# EAGLE schematic BEP33_12panel stencil (EAGLE 7.7.0), part 3 of 4
## Sheet 10 of 14
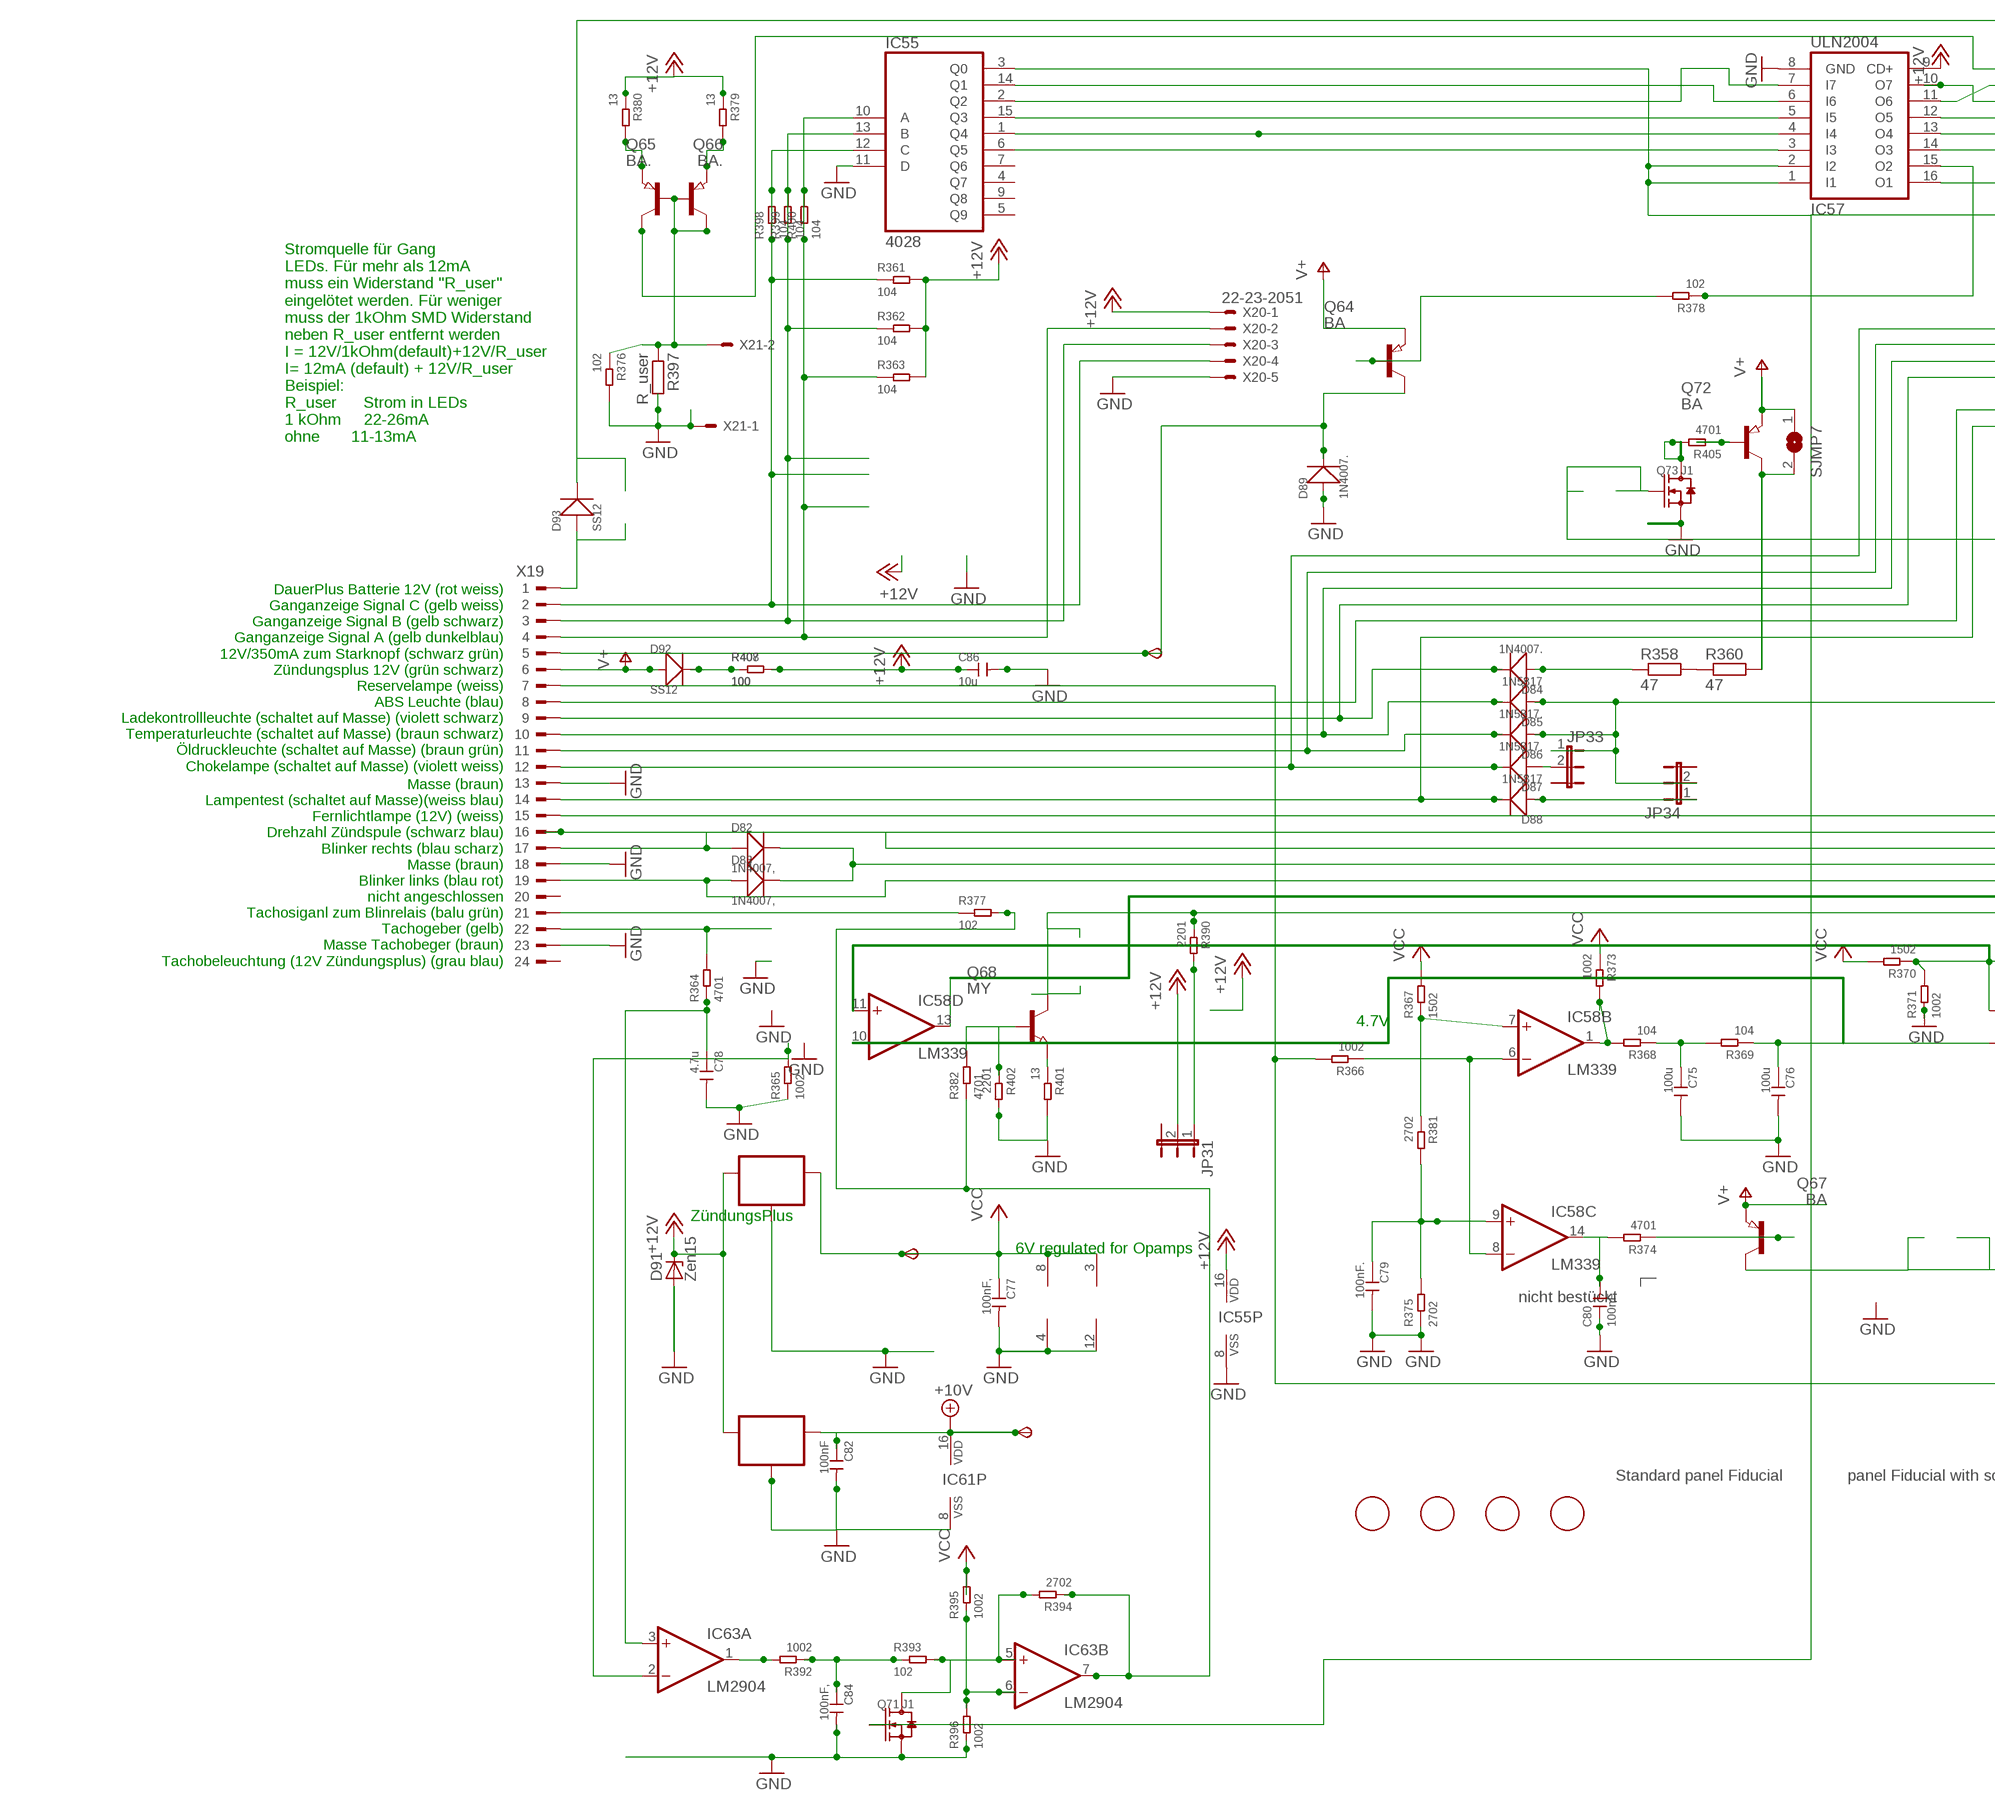
[diagram p16: schematic, sheet 10, part 1 of 2]
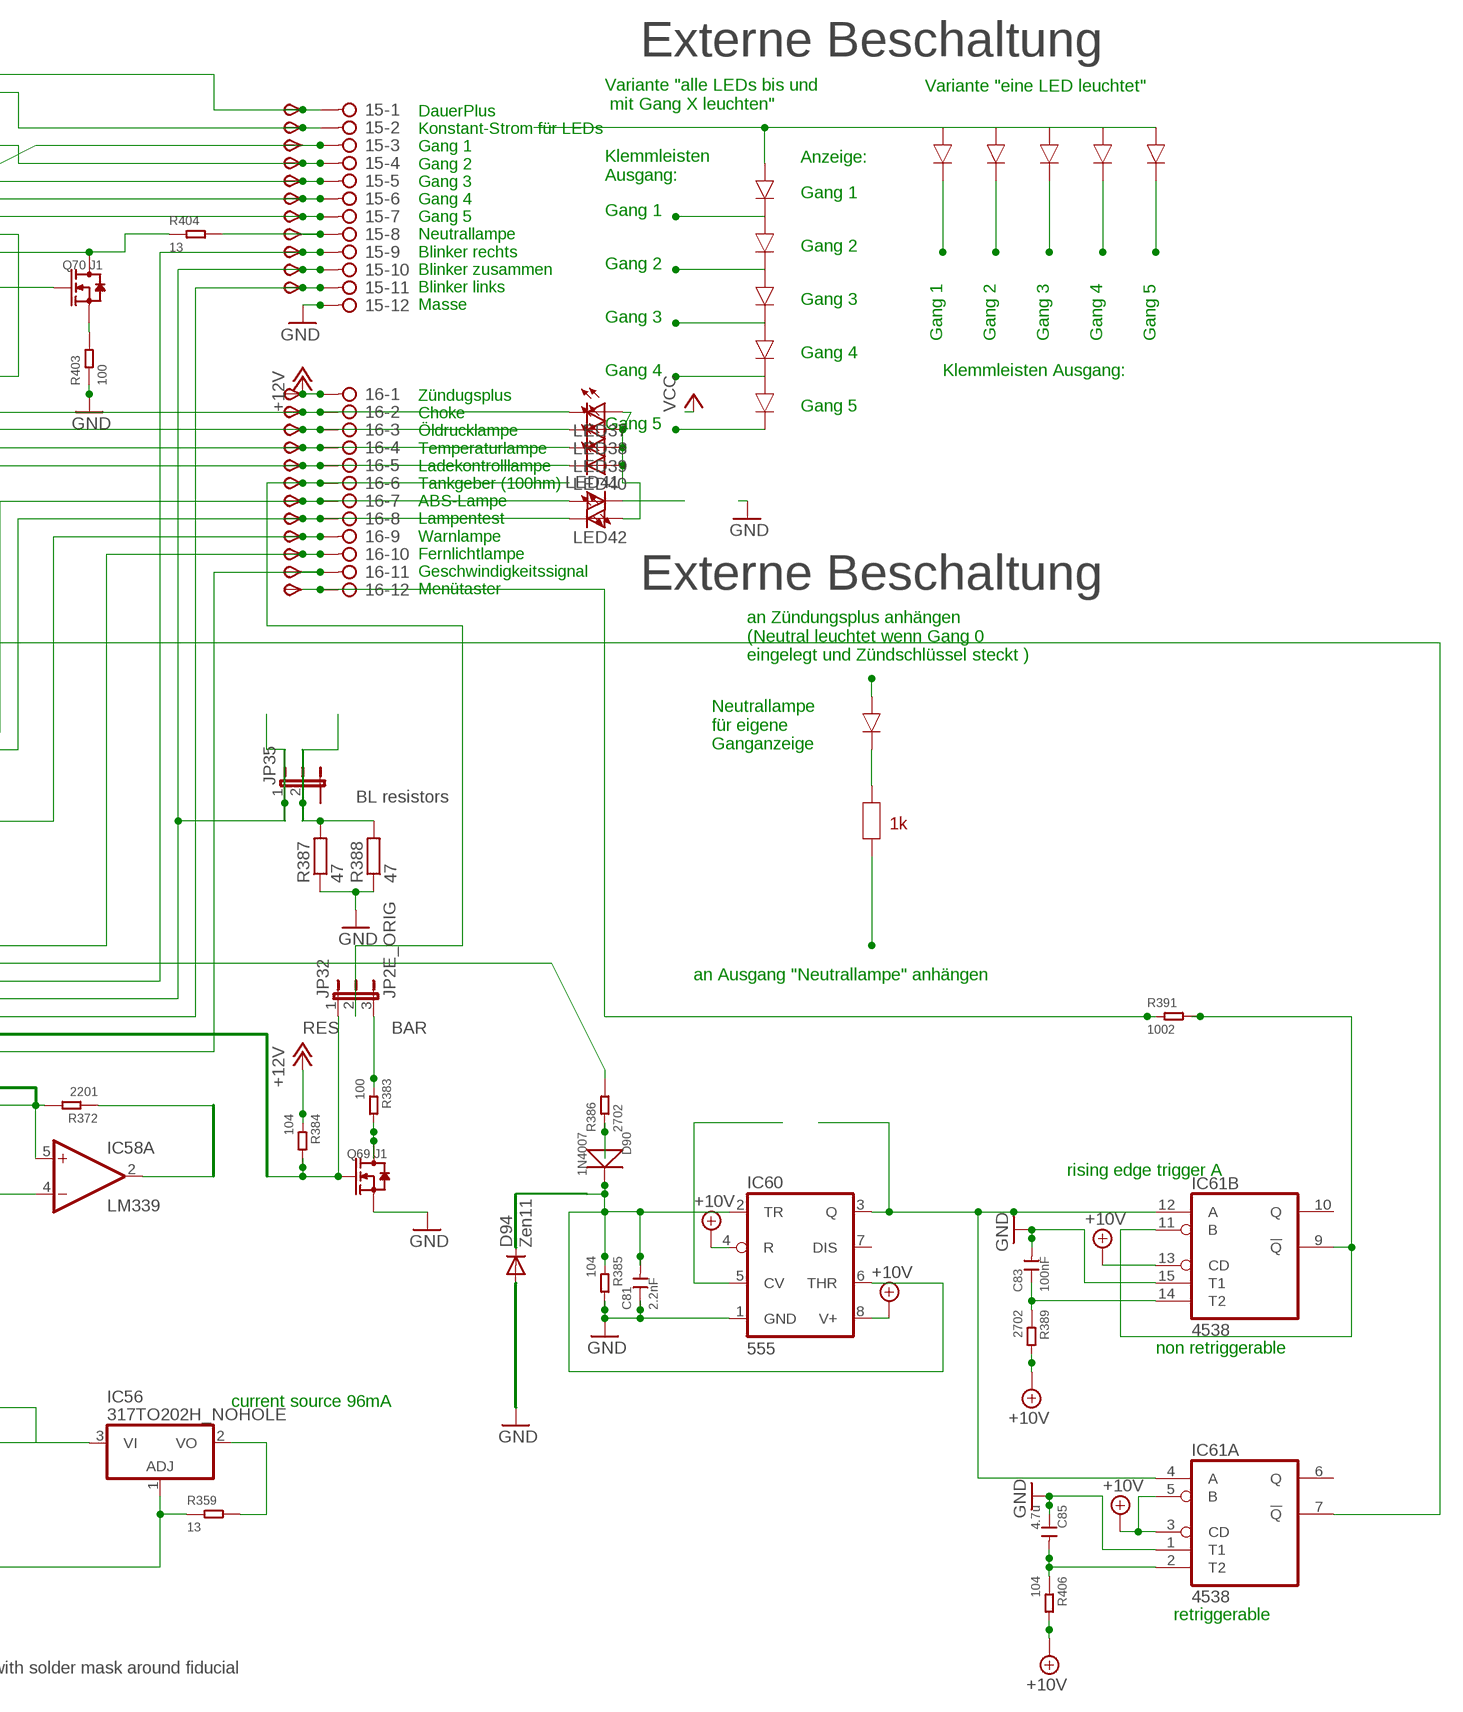
[diagram p17: schematic, sheet 10, part 2 of 2]

### Parts
6V7  TPSB2.0  [B2.0]
10V7  TPSB2.0  [B2.0]
15  2081-1132  [12-PIN]
16  2081-1132  [12-PIN]
C75  100u  CERAMIC-100UF-6.3V-20%-X5R(1206)  [C1206]
C76  100u  CERAMIC-100UF-6.3V-20%-X5R(1206)  [C1206]
C77  100nF,  CERAMIC-100NF-50V-10%-X7R(0805)  [C0805]
C78  4.7u  CERAMIC-4.7UF-25V-10%-X5R(0805)  [C0805]
C79  100nF.  CERAMIC-100NF-50V-10%-X7R(0805)  [C0805]
C80  100nF.  CERAMIC-100NF-50V-10%-X7R(0805)  [C0805]
C81  2.2nF  CERAMIC-100NF-50V-10%-X7R(0805)  [C0805]
C82  100nF  CERAMIC-100NF-50V-10%-X7R(0805)  [C0805]
C83  100nF  CERAMIC-100NF-50V-10%-X7R(0805)  [C0805]
C84  100nF,  CERAMIC-100NF-50V-10%-X7R(0805)  [C0805]
C85  4.7u  CERAMIC-4.7UF-25V-10%-X5R(0805)  [C0805]
C86  10u  CERAMIC-100UF-6.3V-20%-X5R(1206)  [C1206]
D82  1N4007,  DIODE-GEN-PURPOSE-1KV-1A(DO-214AC)  [DO-214AC]
D83  1N4007,  DIODE-GEN-PURPOSE-1KV-1A(DO-214AC)  [DO-214AC]
D84  1N4007.  DIODE-GEN-PURPOSE-1KV-1A(DO-214AC)  [DO-214AC]
D85  1N5817  DIODE-GEN-PURPOSE-1KV-1A(DO-214AC)DO-214AC/1206  [DO-214AC_SLIM]
D86  1N5817.  DIODE-GEN-PURPOSE-1KV-1A(DO-214AC)DO-214AC/1206  [DO-214AC_SLIM]
D87  1N5817.  DIODE-GEN-PURPOSE-1KV-1A(DO-214AC)DO-214AC/1206  [DO-214AC_SLIM]
D88  1N5817  DIODE-GEN-PURPOSE-1KV-1A(DO-214AC)DO-214AC/1206  [DO-214AC_SLIM]
D89  1N4007.  DIODE-GEN-PURPOSE-1KV-1A(DO-214AC)  [DO-214AC]
D90  1N4007  DIODE-GEN-PURPOSE-1KV-1A(DO-214AC)  [DO-214AC]
D91  Zen15  SM6T  [DO214AA]
D92  SS12  DIODE-GEN-PURPOSE-1KV-1A(DO-214AC)DO-214AC/1206  [DO-214AC_SLIM]
D93  SS12  DIODE-GEN-PURPOSE-1KV-1A(DO-214AC)DO-214AC/1206  [DO-214AC_SLIM]
D94  Zen11  CGRM4001-G  [SOD-123_MINI-SMA]
FID29  FIDUCIAL  [FIDUCIAL_1MM]
FID30  FIDUCIAL  [FIDUCIAL_1MM]
FID31  FIDUCIAL  [FIDUCIAL_1MM]
FID32  FIDUCIAL  [FIDUCIAL_1MM]
IC55  4028  4028D  [SO16]
IC56  317TO202H_NOHOLE  [TO220H_NOHOLE]
IC57  ULN2004  ULN2004AD  [SO16]
IC58  LM339  LM339D  [SO14]
IC59  78L06  78LXXSOT89_ROUND  [SOT89_ROUND]
IC60  555  NE555D  [SO08]
IC61  4538  4538D  [SO16]
IC62  78L10  78LXXSOT89_ROUND  [SOT89_ROUND]
IC63  LM2904  LM358D  [SO08]
JP31  JP2EJP2_SMALLPADS  [JP2_SMALLPADS]
JP32  JP2E_ORIG  [JP2_ORIG_SMALLPADS]
JP33  JP2EJP2_SMALLPADS  [JP2_SMALLPADS]
JP34  JP2EJP2_SMALLPADS  [JP2_SMALLPADS]
JP35  JP2EJP2_SMALLPADS  [JP2_SMALLPADS]
LED37  LEDLD260  [LD260]
LED38  LEDLD260  [LD260]
LED39  LEDLD260  [LD260]
LED40  LEDLD260  [LD260]
LED41  LEDLD260  [LD260]
LED42  LEDLD260  [LD260]
Q64  BA  PNP-TRANSISTOR_SOT89  [SOT89]
Q65  BA.  PNP-TRANSISTOR_SOT89  [SOT89]
Q66  BA.  PNP-TRANSISTOR_SOT89  [SOT89]
Q67  BA  PNP-TRANSISTOR_SOT89  [SOT89]
Q68  MY  NPN-TRANSISTOR_SOT89  [SOT89]
Q69  J1  SMD-MOSFET-N-CH-50V-200MA-BSS138W-7-F(SOT-23)  [SOT-23]
Q70  J1  SMD-MOSFET-N-CH-50V-200MA-BSS138W-7-F(SOT-23)  [SOT-23]
Q71  J1  SMD-MOSFET-N-CH-50V-200MA-BSS138W-7-F(SOT-23)  [SOT-23]
Q72  BA  PNP-TRANSISTOR_SOT89  [SOT89]
Q73  J1  SMD-MOSFET-N-CH-50V-200MA-BSS138W-7-F(SOT-23)  [SOT-23]
R358  47  R-EU_V235/17_1MM  [V235/17_1MM]
R359  13  SMD-RES-13R-5%-1/4W(1206)  [R1206]
R360  47  R-EU_V235/17_1MM  [V235/17_1MM]
R361  104  SMD-RES-10K-1%-1/8W(0805)  [R0805]
R362  104  SMD-RES-10K-1%-1/8W(0805)  [R0805]
R363  104  SMD-RES-10K-1%-1/8W(0805)  [R0805]
R364  4701  SMD-RES-4.7K-5%-1/8W(0805)  [R0805]
R365  1002  SMD-RES-10K-1%-1/8W(0805)  [R0805]
R366  1002  SMD-RES-10K-1%-1/8W(0805)  [R0805]
R367  1502  SMD-RES-10K-1%-1/8W(0805)  [R0805]
R368  104  SMD-RES-10K-1%-1/8W(0805)  [R0805]
R369  104  SMD-RES-10K-1%-1/8W(0805)  [R0805]
R370  1502  SMD-RES-10K-1%-1/8W(0805)  [R0805]
R371  1002  SMD-RES-10K-1%-1/8W(0805)  [R0805]
R372  2201  SMD-RES-2.2K-5%-1/8W(0805)  [R0805]
R373  1002  SMD-RES-10K-1%-1/8W(0805)  [R0805]
R374  4701  SMD-RES-4.7K-5%-1/8W(0805)  [R0805]
R375  2702  SMD-RES-4.7K-5%-1/8W(0805)  [R0805]
R376  102  SMD-RES-1K-5%-1/8W(0805)  [R0805]
R377  102  SMD-RES-220R-5%-1/8W(0805)  [R0805]
R378  102  SMD-RES-1K-5%-1/8W(0805)  [R0805]
R379  13  SMD-RES-13R-5%-1/4W(1206)  [R1206]
R380  13  SMD-RES-13R-5%-1/4W(1206)  [R1206]
R381  2702  SMD-RES-4.7K-5%-1/8W(0805)  [R0805]
R382  4701  SMD-RES-4.7K-5%-1/8W(0805)  [R0805]
R383  100  SMD-RES-2.2K-5%-1/8W(0805)  [R0805]
R384  104  SMD-RES-10K-1%-1/8W(0805)  [R0805]
R385  104  SMD-RES-10K-1%-1/8W(0805)  [R0805]
R386  2702  SMD-RES-10K-1%-1/8W(0805)  [R0805]
R387  47  R-EU_V235/17_1MM  [V235/17_1MM]
R388  47  R-EU_V235/17_1MM  [V235/17_1MM]
R389  2702  SMD-RES-4.7K-5%-1/8W(0805)  [R0805]
R390  2201  SMD-RES-2.2K-5%-1/8W(0805)  [R0805]
R391  1002  SMD-RES-4.7K-5%-1/8W(0805)  [R0805]
R392  1002  SMD-RES-10K-1%-1/8W(0805)  [R0805]
R393  102  SMD-RES-1K-5%-1/8W(0805)  [R0805]
R394  2702  SMD-RES-4.7K-5%-1/8W(0805)  [R0805]
R395  1002  SMD-RES-1K-5%-1/8W(0805)  [R0805]
R396  1002  SMD-RES-1K-5%-1/8W(0805)  [R0805]
R397  R_user  R-EU_R0805  [R0805]
R398  104  SMD-RES-10K-1%-1/8W(0805)  [R0805]
R399  104  SMD-RES-10K-1%-1/8W(0805)  [R0805]
R400  104  SMD-RES-10K-1%-1/8W(0805)  [R0805]
R401  13  SMD-RES-13R-5%-1/4W(1206)  [R1206]
R402  2201  SMD-RES-1K-5%-1/8W(0805)  [R0805]
R403  100  SMD-RES-220R-5%-1/8W(0805)  [R0805]
R404  13  SMD-RES-13R-5%-1/4W(1206)  [R1206]
R405  4701  SMD-RES-4.7K-5%-1/8W(0805)  [R0805]
R406  104  SMD-RES-4.7K-5%-1/8W(0805)  [R0805]
R407  100  SMD-RES-2.2K-5%-1/8W(0805)  [R0805]
R408  100  SMD-RES-2.2K-5%-1/8W(0805)  [R0805]
SJMP7  SJ  [SJ]
START7  TPSB2.0  [B2.0]
TP162  TPSB2.0  [B2.0]
TP163  TPSB2.0  [B2.0]
TP164  TPSB2.0  [B2.0]
TP165  TPSB2.0  [B2.0]
TP166  TPSB2.0  [B2.0]
TP167  TPSB2.0  [B2.0]
TP168  TPSB2.0  [B2.0]
TP169  TPSB2.0  [B2.0]
TP170  TPSB2.0  [B2.0]
TP171  TPSB2.0  [B2.0]
TP172  TPSB2.0  [B2.0]
TP173  TPSB2.0  [B2.0]
TP174  TPSB2.0  [B2.0]
TP175  TPSB2.0  [B2.0]
TP176  TPSB2.0  [B2.0]
TP177  TPSB2.0  [B2.0]
TP178  TPSB2.0  [B2.0]
TP179  TPSB2.0  [B2.0]
TP180  TPSB1,27  [B1,27]
TP181  TPSB2.0  [B2.0]
TP182  TPSB2.0  [B2.0]
TP183  TPSB2.0  [B2.0]
TP184  TPSB2.0  [B2.0]
X19  CON_BMWV2  [24-PIN_V2]
X20  22-23-2051  [22-23-2051]
X21  22-23-2021  [22-23-2021]

### Nets
+10V: 10V7.TP(PP) C82.1 IC60.4(R) IC60.8(V+) IC61.3(A:CD) IC61.5(A:B) IC61.13(B:CD) IC61.16(P:VDD) IC62.1(OUT) R389.2 R406.2 ; also sheet 2,3,4,5,6,7,9,11,12,13,14
+12V: 16.1 C86.1 D91.C IC55.16(VDD) IC57.9(CD+) IC59.3(IN) IC62.3(IN) JP31.2 R361.2 R362.2 R363.2 R379.1 R380.1 R384.1 R407.2 R408.2 TP183.TP(PP) X20.1 ; also sheet 2,3,4,5,6,7,9,11,12,13,14
+12V8: 16.11 Q68.2(C) R390.1 TP182.TP(PP)
GND: 15.12 C75.2 C76.2 C77.2 C78.2 C79.2 C80.1 C81.1 C82.2 C83.2 C84.2 C85.1 C86.2 D89.1(+) D91.A D94.A IC55.8(VSS) IC55.11(D) IC57.8(GND) IC58.12(P:GND) IC59.2(GND) IC59.2@1(GND) IC60.1(GND) IC61.1(A:T1) IC61.8(P:VSS) IC61.15(B:T1) IC62.2(GND) IC62.2@1(GND) IC63.4(P:V-) Q69.2(S) Q71.2(S) Q73.2(S) R365.1 R371.1 R375.1 R376.2 R385.2 R387.1 R388.1 R396.1 R397.2 R401.2 R402.2 R403.1 X19.13 X19.18 X19.23 X20.5 X21.1 ; also sheet 2,3,4,5,6,7,9,11,12,13,14
N$1500: R358.2 R360.1
N$1501: 16.9 D85.1(+) D86.1(+) JP33.1 JP34.2 TP180.TP(PP)
N$1502: IC55.10(A) R363.1 R400.1 R400.2 X19.4 X20.2
N$1503: IC55.13(B) R362.1 R399.1 R399.2 X19.3 X20.3
N$1504: D89.2(-) Q64.2(C) START7.TP(PP) X19.5
N$1505: IC55.12(C) R361.1 R398.1 R398.2 X19.2 X20.4
N$1506: 16.7 LED41.A TP178.TP(PP) X19.8
N$1507: 16.2 D87.2(-) LED37.K(C) TP173.TP(PP) X19.12
N$1508: 16.3 D86.2(-) LED38.K(C) TP174.TP(PP) X19.11
N$1509: 16.4 D85.2(-) LED39.K(C) TP175.TP(PP) X19.10
N$1510: 16.8 D88.2(-) LED42.K(C) TP179.TP(PP) X19.14
N$1511: 15.9 D82.1(+) TP170.TP(PP) X19.17
N$1512: 15.11 D83.1(+) TP172.TP(PP) X19.19
N$1513: R364.2 X19.22
N$1514: C78.1 IC63.3(A:+IN) R364.1
N$1515: IC58.1(B:OUT) R368.2 R373.2
N$1516: C75.1 R368.1 R369.2
N$1517: C76.1 IC58.4(A:-IN) IC58.10(D:-IN) R369.1
N$1518: IC58.5(A:+IN) IC58.11(D:+IN) R370.1 R371.2 R372.2
N$1519: C79.1 IC58.9(C:+IN) R375.2 R381.2
N$1520: C80.2 IC58.14(C:OUT) R374.2
N$1521: Q67.1(B) R374.1
N$1522: IC55.2(Q2) IC57.7(I7)
N$1523: 15.5 IC57.12(O5) TP166.TP(PP)
N$1524: IC55.1(Q4) IC57.4(I4)
N$1525: 16.10 TP181.TP(PP) X19.15
N$1526: 16.5 D84.2(-) LED40.K(C) TP176.TP(PP) X19.9
N$1527: D84.1(+) R358.1
N$1528: IC55.6(Q5) IC57.3(I3)
N$1529: 15.4 IC57.10(O7) TP165.TP(PP)
N$1530: IC56.1(ADJ) R359.1 R366.2 X19.7
N$1531: IC58.6(B:-IN) IC58.8(C:-IN) R366.1
N$1532: 15.2 Q66.2(C) TP163.TP(PP)
N$1533: 15.1 D93.2(-) TP162.TP(PP)
N$1547: R386.2 X19.16
N$1548: IC55.15(Q3) IC57.5(I5)
N$1549: 15.6 IC57.13(O4) TP167.TP(PP)
N$1550: 15.7 IC57.14(O3) TP168.TP(PP)
N$1551: 16.6 JP32.2 TP177.TP(PP)
N$1552: LED41.K(C)
N$1553: LED37.A LED38.A LED39.A LED40.A LED42.A
N$1554: Q64.1(B) R378.2
N$1555: IC55.3(Q0) IC57.1(I1) IC57.2(I2) Q70.1(G) Q71.1(G)
N$1556: IC55.14(Q1) IC57.6(I6)
N$1557: 15.3 IC57.11(O6) TP164.TP(PP)
N$1558: Q65.1(B) Q65.2(C) Q66.1(B) R376.1 R397.1 X21.2
N$1559: Q66.3(E) R380.2
N$1560: Q65.3(E) R379.2
N$1561: IC58.7(B:+IN) R367.1 R381.1
N$1562: IC63.2(A:-IN) R365.2
N$1563: Q68.1(B) R382.2 R402.1
N$1564: Q69.3(D) R383.2
N$1565: IC56.2(VO) R359.2
N$1566: IC56.3(VI) Q67.2(C)
N$1567: IC60.5(CV)
N$1568: IC60.3(Q) IC61.4(A:A) IC61.12(B:A)
N$1569: D90.1(+) R386.1
N$1570: 15.10 D82.2(-) D83.2(-) JP35.1 TP171.TP(PP)
N$1571: JP35.2 R387.2 R388.2
N$1572: IC61.9(B:!Q) IC61.11(B:B) R391.2
N$1573: C83.1 IC61.14(B:T2) R389.1
N$1574: JP31.1 R390.2
N$1575: IC57.15(O2) R378.1
N$1576: 16.12 R391.1 TP184.TP(PP)
N$1577: D87.1(+) JP33.2
N$1578: IC63.1(A:OUT) R392.2
N$1579: C84.1 R392.1 R393.1
N$1580: IC63.5(B:+IN) Q71.3(D) R393.2 R394.2
N$1581: IC63.6(B:-IN) R395.1 R396.2
N$1582: D88.1(+) JP34.1
N$1583: JP32.3 R383.1
N$1584: IC58.13(D:OUT) JP32.1 Q69.1(G) R384.2
N$1585: R377.1 X19.21
N$1586: IC57.16(O1) Q70.3(D) R404.1
N$1587: D92.2(-) R407.1 R408.1
N$1588: 15.8 R404.2 TP169.TP(PP)
N$1589: Q70.2(S) R403.2
N$1590: D93.1(+) X19.1
N$1591: Q68.3(E) R401.1
N$1592: C81.2 D90.2(-) D94.C IC60.2(TR) IC60.6(THR) R385.1
N$1593: Q72.1(B) R405.1
N$1594: Q73.3(D) R405.2
N$1595: Q72.2(C) R360.2 SJMP7.2
N$1596: IC63.7(B:OUT) R377.2 R382.1 R394.1
N$1597: IC58.2(A:OUT) R372.1
N$1598: IC61.7(A:!Q) Q73.1(G)
N$1599: C85.2 IC61.2(A:T2) R406.1
V+: D92.1(+) Q64.3(E) Q67.3(E) Q72.3(E) SJMP7.1 X19.6 ; also sheet 2,3,4,5,6,7,9,11,12,13,14
VCC: 6V7.TP(PP) C77.1 IC58.3(P:V+) IC59.1(OUT) IC63.8(P:V+) R367.2 R370.2 R373.1 R395.2 ; also sheet 2,3,4,5,6,7,9,11,12,13,14
Unconnected: IC55.4(Q7) IC55.5(Q9) IC55.7(Q6) IC55.9(Q8) IC60.7(DIS) IC61.6(A:Q) IC61.10(B:Q) X19.20 X19.24

### Notes on the sheet
- Externe Beschaltung
- Variante "eine LED leuchtet"
- Variante "alle LEDs bis und
   mit Gang X leuchten"
- Anzeige:
- Klemmleisten
  Ausgang:
- Gang 1
- DauerPlus
  Konstant-Strom für LEDs
  Gang 1
  Gang 2
  Gang 3
  Gang 4
  Gang 5
  Neutrallampe
  Blinker rechts
  Blinker zusammen
  Blinker links
  Masse
- Gang 1
- Gang 2
- Gang 2
- Gang 3
- Gang 3
- Gang 1 | Gang 2 | Gang 3 | Gang 4 | Gang 5
- Gang 4
- Gang 4 | Klemmleisten Ausgang:
- Gang 5
- Gang 5
- Zündugsplus
  Choke
  Öldrucklampe
  Temperaturlampe
  Ladekontrolllampe
  Tankgeber (100hm)
  ABS-Lampe
  Lampentest
  Warnlampe
  Fernlichtlampe
  Geschwindigkeitssignal
  Menütaster
- Stromquelle für Gang
  LEDs. Für mehr als 12mA
  muss ein Widerstand "R_user"
  eingelötet werden. Für weniger
  muss der 1kOhm SMD Widerstand
  neben R_user entfernt werden
  I = 12V/1kOhm(default)+12V/R_user
  I= 12mA (default) + 12V/R_user
  Beispiel:
  R_user      Strom in LEDs
  1 kOhm     22-26mA
  ohne       11-13mA
- Externe Beschaltung
- an Zündungsplus anhängen
  (Neutral leuchtet wenn Gang 0
  eingelegt und Zündschlüssel steckt )
- Neutrallampe
  für eigene
  Ganganzeige
- DauerPlus Batterie 12V (rot weiss)
  Ganganzeige Signal C (gelb weiss)
  Ganganzeige Signal B (gelb schwarz)
  Ganganzeige Signal A (gelb dunkelblau)
  12V/350mA zum Starknopf (schwarz grün)
  Zündungsplus 12V (grün schwarz)
  Reservelampe (weiss)
  ABS Leuchte (blau)
  Ladekontrollleuchte (schaltet auf Masse) (violett schwarz)
  Temperaturleuchte (schaltet auf Masse) (braun schwarz)
  Öldruckleuchte (schaltet auf Masse) (braun grün)
  Chokelampe (schaltet auf Masse) (violett weiss)
- BL resistors
- 1k
- an Ausgang "Neutrallampe" anhängen
- Masse (braun)
  Lampentest (schaltet auf Masse)(weiss blau)
  Fernlichtlampe (12V) (weiss)
  Drehzahl Zündspule (schwarz blau)
  Blinker rechts (blau scharz)
  Masse (braun)
  Blinker links (blau rot)
  nicht angeschlossen
  Tachosiganl zum Blinrelais (balu grün)
  Tachogeber (gelb)
  Masse Tachobeger (braun)
  Tachobeleuchtung (12V Zündungsplus) (grau blau)
- RES | BAR
- 4.7V | rising edge trigger A
- non retriggerable
- ZündungsPlus
- current source 96mA
- 6V regulated for Opamps
- nicht bestückt
- retriggerable
- Standard panel Fiducial | panel Fiducial with solder mask around fiducial

## Sheet 11 of 14
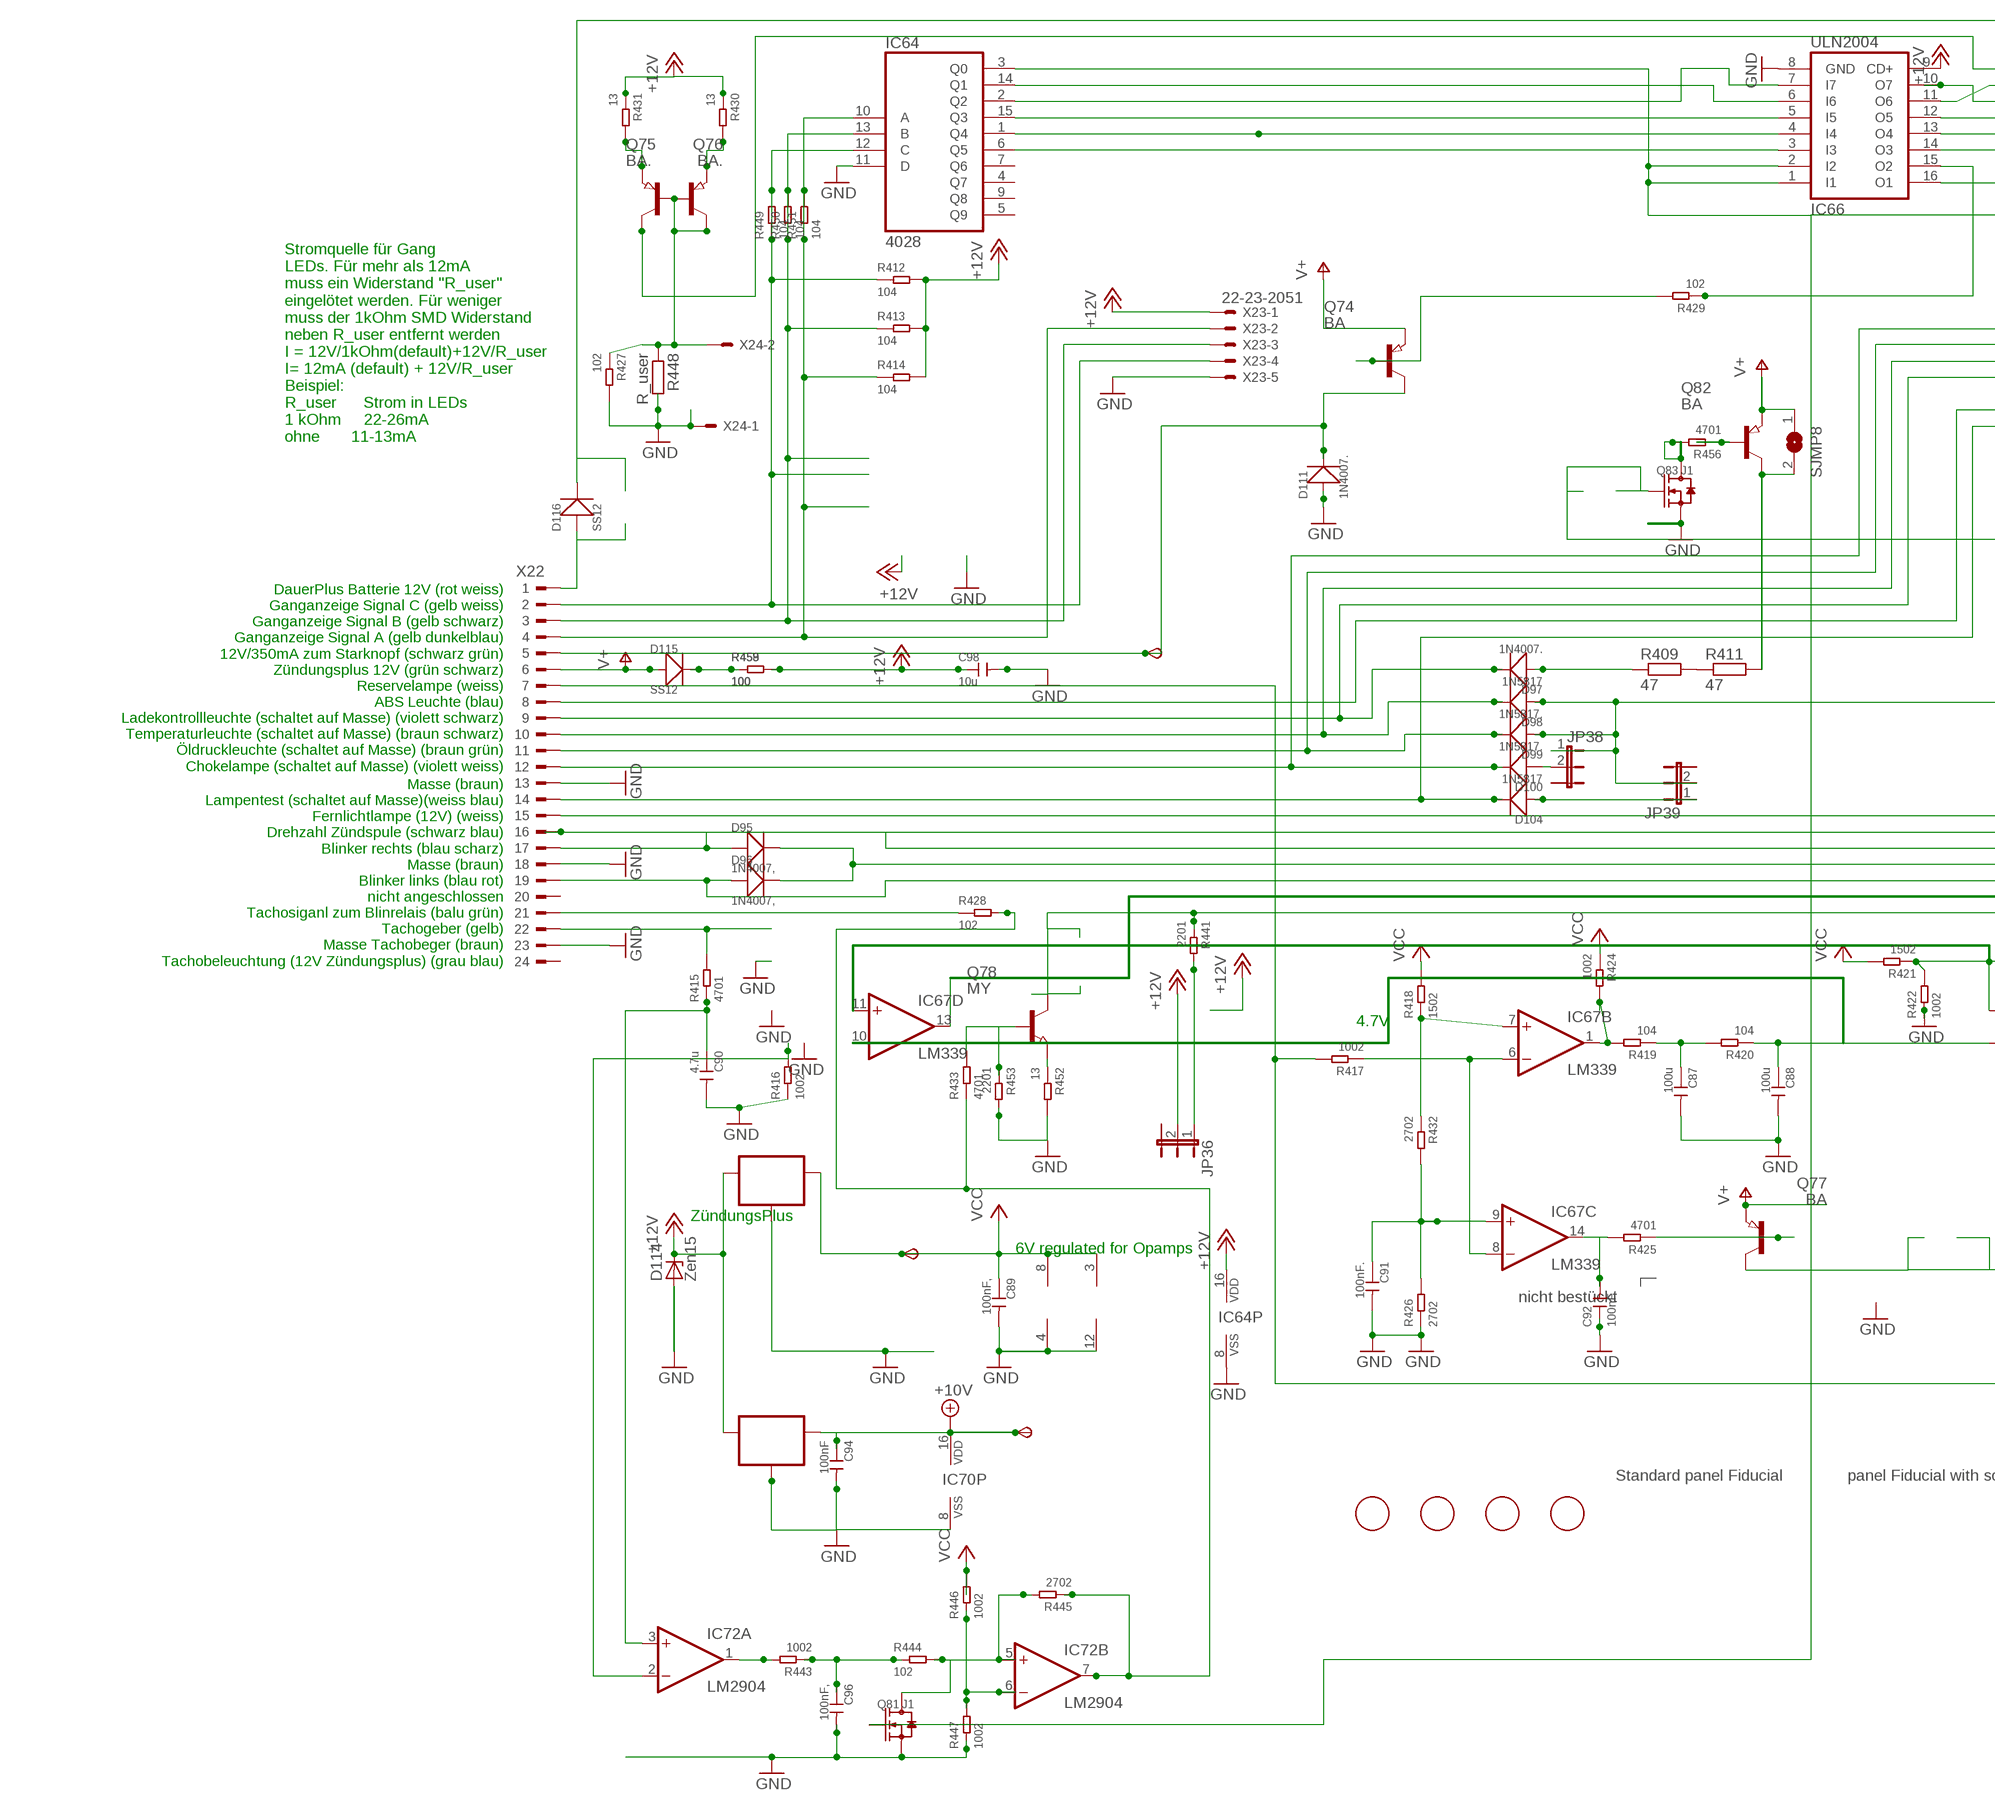
[diagram p18: schematic, sheet 11, part 1 of 2]
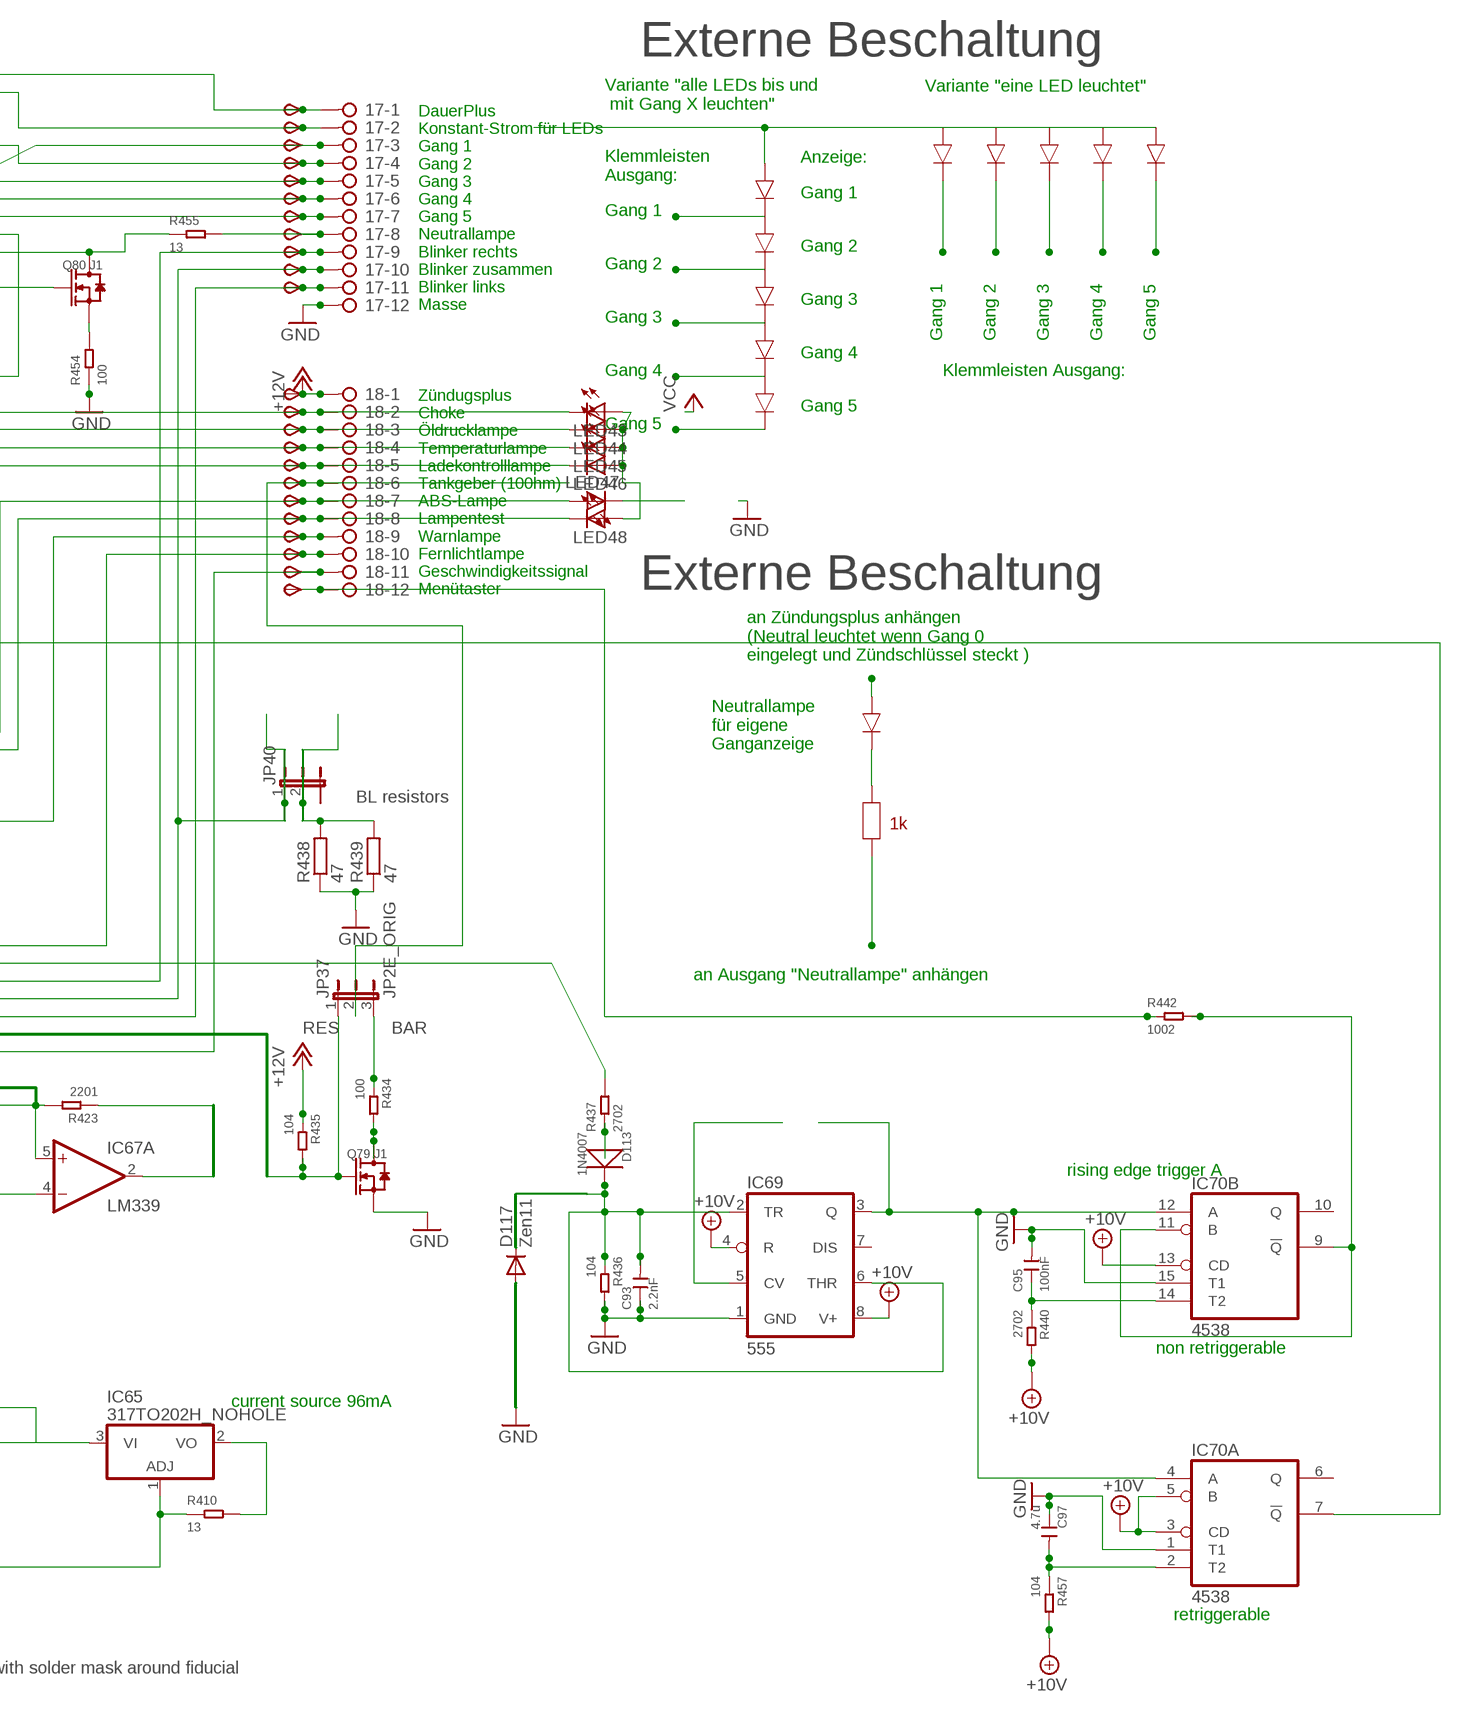
[diagram p19: schematic, sheet 11, part 2 of 2]

### Parts
6V8  TPSB2.0  [B2.0]
10V8  TPSB2.0  [B2.0]
17  2081-1132  [12-PIN]
18  2081-1132  [12-PIN]
C87  100u  CERAMIC-100UF-6.3V-20%-X5R(1206)  [C1206]
C88  100u  CERAMIC-100UF-6.3V-20%-X5R(1206)  [C1206]
C89  100nF,  CERAMIC-100NF-50V-10%-X7R(0805)  [C0805]
C90  4.7u  CERAMIC-4.7UF-25V-10%-X5R(0805)  [C0805]
C91  100nF.  CERAMIC-100NF-50V-10%-X7R(0805)  [C0805]
C92  100nF.  CERAMIC-100NF-50V-10%-X7R(0805)  [C0805]
C93  2.2nF  CERAMIC-100NF-50V-10%-X7R(0805)  [C0805]
C94  100nF  CERAMIC-100NF-50V-10%-X7R(0805)  [C0805]
C95  100nF  CERAMIC-100NF-50V-10%-X7R(0805)  [C0805]
C96  100nF,  CERAMIC-100NF-50V-10%-X7R(0805)  [C0805]
C97  4.7u  CERAMIC-4.7UF-25V-10%-X5R(0805)  [C0805]
C98  10u  CERAMIC-100UF-6.3V-20%-X5R(1206)  [C1206]
D95  1N4007,  DIODE-GEN-PURPOSE-1KV-1A(DO-214AC)  [DO-214AC]
D96  1N4007,  DIODE-GEN-PURPOSE-1KV-1A(DO-214AC)  [DO-214AC]
D97  1N4007.  DIODE-GEN-PURPOSE-1KV-1A(DO-214AC)  [DO-214AC]
D98  1N5817  DIODE-GEN-PURPOSE-1KV-1A(DO-214AC)DO-214AC/1206  [DO-214AC_SLIM]
D99  1N5817.  DIODE-GEN-PURPOSE-1KV-1A(DO-214AC)DO-214AC/1206  [DO-214AC_SLIM]
D100  1N5817.  DIODE-GEN-PURPOSE-1KV-1A(DO-214AC)DO-214AC/1206  [DO-214AC_SLIM]
D104  1N5817  DIODE-GEN-PURPOSE-1KV-1A(DO-214AC)DO-214AC/1206  [DO-214AC_SLIM]
D111  1N4007.  DIODE-GEN-PURPOSE-1KV-1A(DO-214AC)  [DO-214AC]
D113  1N4007  DIODE-GEN-PURPOSE-1KV-1A(DO-214AC)  [DO-214AC]
D114  Zen15  SM6T  [DO214AA]
D115  SS12  DIODE-GEN-PURPOSE-1KV-1A(DO-214AC)DO-214AC/1206  [DO-214AC_SLIM]
D116  SS12  DIODE-GEN-PURPOSE-1KV-1A(DO-214AC)DO-214AC/1206  [DO-214AC_SLIM]
D117  Zen11  CGRM4001-G  [SOD-123_MINI-SMA]
FID33  FIDUCIAL  [FIDUCIAL_1MM]
FID34  FIDUCIAL  [FIDUCIAL_1MM]
FID35  FIDUCIAL  [FIDUCIAL_1MM]
FID36  FIDUCIAL  [FIDUCIAL_1MM]
IC64  4028  4028D  [SO16]
IC65  317TO202H_NOHOLE  [TO220H_NOHOLE]
IC66  ULN2004  ULN2004AD  [SO16]
IC67  LM339  LM339D  [SO14]
IC68  78L06  78LXXSOT89_ROUND  [SOT89_ROUND]
IC69  555  NE555D  [SO08]
IC70  4538  4538D  [SO16]
IC71  78L10  78LXXSOT89_ROUND  [SOT89_ROUND]
IC72  LM2904  LM358D  [SO08]
JP36  JP2EJP2_SMALLPADS  [JP2_SMALLPADS]
JP37  JP2E_ORIG  [JP2_ORIG_SMALLPADS]
JP38  JP2EJP2_SMALLPADS  [JP2_SMALLPADS]
JP39  JP2EJP2_SMALLPADS  [JP2_SMALLPADS]
JP40  JP2EJP2_SMALLPADS  [JP2_SMALLPADS]
LED43  LEDLD260  [LD260]
LED44  LEDLD260  [LD260]
LED45  LEDLD260  [LD260]
LED46  LEDLD260  [LD260]
LED47  LEDLD260  [LD260]
LED48  LEDLD260  [LD260]
Q74  BA  PNP-TRANSISTOR_SOT89  [SOT89]
Q75  BA.  PNP-TRANSISTOR_SOT89  [SOT89]
Q76  BA.  PNP-TRANSISTOR_SOT89  [SOT89]
Q77  BA  PNP-TRANSISTOR_SOT89  [SOT89]
Q78  MY  NPN-TRANSISTOR_SOT89  [SOT89]
Q79  J1  SMD-MOSFET-N-CH-50V-200MA-BSS138W-7-F(SOT-23)  [SOT-23]
Q80  J1  SMD-MOSFET-N-CH-50V-200MA-BSS138W-7-F(SOT-23)  [SOT-23]
Q81  J1  SMD-MOSFET-N-CH-50V-200MA-BSS138W-7-F(SOT-23)  [SOT-23]
Q82  BA  PNP-TRANSISTOR_SOT89  [SOT89]
Q83  J1  SMD-MOSFET-N-CH-50V-200MA-BSS138W-7-F(SOT-23)  [SOT-23]
R409  47  R-EU_V235/17_1MM  [V235/17_1MM]
R410  13  SMD-RES-13R-5%-1/4W(1206)  [R1206]
R411  47  R-EU_V235/17_1MM  [V235/17_1MM]
R412  104  SMD-RES-10K-1%-1/8W(0805)  [R0805]
R413  104  SMD-RES-10K-1%-1/8W(0805)  [R0805]
R414  104  SMD-RES-10K-1%-1/8W(0805)  [R0805]
R415  4701  SMD-RES-4.7K-5%-1/8W(0805)  [R0805]
R416  1002  SMD-RES-10K-1%-1/8W(0805)  [R0805]
R417  1002  SMD-RES-10K-1%-1/8W(0805)  [R0805]
R418  1502  SMD-RES-10K-1%-1/8W(0805)  [R0805]
R419  104  SMD-RES-10K-1%-1/8W(0805)  [R0805]
R420  104  SMD-RES-10K-1%-1/8W(0805)  [R0805]
R421  1502  SMD-RES-10K-1%-1/8W(0805)  [R0805]
R422  1002  SMD-RES-10K-1%-1/8W(0805)  [R0805]
R423  2201  SMD-RES-2.2K-5%-1/8W(0805)  [R0805]
R424  1002  SMD-RES-10K-1%-1/8W(0805)  [R0805]
R425  4701  SMD-RES-4.7K-5%-1/8W(0805)  [R0805]
R426  2702  SMD-RES-4.7K-5%-1/8W(0805)  [R0805]
R427  102  SMD-RES-1K-5%-1/8W(0805)  [R0805]
R428  102  SMD-RES-220R-5%-1/8W(0805)  [R0805]
R429  102  SMD-RES-1K-5%-1/8W(0805)  [R0805]
R430  13  SMD-RES-13R-5%-1/4W(1206)  [R1206]
R431  13  SMD-RES-13R-5%-1/4W(1206)  [R1206]
R432  2702  SMD-RES-4.7K-5%-1/8W(0805)  [R0805]
R433  4701  SMD-RES-4.7K-5%-1/8W(0805)  [R0805]
R434  100  SMD-RES-2.2K-5%-1/8W(0805)  [R0805]
R435  104  SMD-RES-10K-1%-1/8W(0805)  [R0805]
R436  104  SMD-RES-10K-1%-1/8W(0805)  [R0805]
R437  2702  SMD-RES-10K-1%-1/8W(0805)  [R0805]
R438  47  R-EU_V235/17_1MM  [V235/17_1MM]
R439  47  R-EU_V235/17_1MM  [V235/17_1MM]
R440  2702  SMD-RES-4.7K-5%-1/8W(0805)  [R0805]
R441  2201  SMD-RES-2.2K-5%-1/8W(0805)  [R0805]
R442  1002  SMD-RES-4.7K-5%-1/8W(0805)  [R0805]
R443  1002  SMD-RES-10K-1%-1/8W(0805)  [R0805]
R444  102  SMD-RES-1K-5%-1/8W(0805)  [R0805]
R445  2702  SMD-RES-4.7K-5%-1/8W(0805)  [R0805]
R446  1002  SMD-RES-1K-5%-1/8W(0805)  [R0805]
R447  1002  SMD-RES-1K-5%-1/8W(0805)  [R0805]
R448  R_user  R-EU_R0805  [R0805]
R449  104  SMD-RES-10K-1%-1/8W(0805)  [R0805]
R450  104  SMD-RES-10K-1%-1/8W(0805)  [R0805]
R451  104  SMD-RES-10K-1%-1/8W(0805)  [R0805]
R452  13  SMD-RES-13R-5%-1/4W(1206)  [R1206]
R453  2201  SMD-RES-1K-5%-1/8W(0805)  [R0805]
R454  100  SMD-RES-220R-5%-1/8W(0805)  [R0805]
R455  13  SMD-RES-13R-5%-1/4W(1206)  [R1206]
R456  4701  SMD-RES-4.7K-5%-1/8W(0805)  [R0805]
R457  104  SMD-RES-4.7K-5%-1/8W(0805)  [R0805]
R458  100  SMD-RES-2.2K-5%-1/8W(0805)  [R0805]
R459  100  SMD-RES-2.2K-5%-1/8W(0805)  [R0805]
SJMP8  SJ  [SJ]
START8  TPSB2.0  [B2.0]
TP185  TPSB2.0  [B2.0]
TP186  TPSB2.0  [B2.0]
TP187  TPSB2.0  [B2.0]
TP188  TPSB2.0  [B2.0]
TP189  TPSB2.0  [B2.0]
TP190  TPSB2.0  [B2.0]
TP191  TPSB2.0  [B2.0]
TP192  TPSB2.0  [B2.0]
TP193  TPSB2.0  [B2.0]
TP194  TPSB2.0  [B2.0]
TP195  TPSB2.0  [B2.0]
TP196  TPSB2.0  [B2.0]
TP197  TPSB2.0  [B2.0]
TP198  TPSB2.0  [B2.0]
TP199  TPSB2.0  [B2.0]
TP200  TPSB2.0  [B2.0]
TP201  TPSB2.0  [B2.0]
TP202  TPSB2.0  [B2.0]
TP203  TPSB1,27  [B1,27]
TP204  TPSB2.0  [B2.0]
TP205  TPSB2.0  [B2.0]
TP206  TPSB2.0  [B2.0]
TP207  TPSB2.0  [B2.0]
X22  CON_BMWV2  [24-PIN_V2]
X23  22-23-2051  [22-23-2051]
X24  22-23-2021  [22-23-2021]

### Nets
+10V: 10V8.TP(PP) C94.1 IC69.4(R) IC69.8(V+) IC70.3(A:CD) IC70.5(A:B) IC70.13(B:CD) IC70.16(P:VDD) IC71.1(OUT) R440.2 R457.2 ; also sheet 2,3,4,5,6,7,9,10,12,13,14
+12V: 18.1 C98.1 D114.C IC64.16(VDD) IC66.9(CD+) IC68.3(IN) IC71.3(IN) JP36.2 R412.2 R413.2 R414.2 R430.1 R431.1 R435.1 R458.2 R459.2 TP206.TP(PP) X23.1 ; also sheet 2,3,4,5,6,7,9,10,12,13,14
+12V9: 18.11 Q78.2(C) R441.1 TP205.TP(PP)
GND: 17.12 C87.2 C88.2 C89.2 C90.2 C91.2 C92.1 C93.1 C94.2 C95.2 C96.2 C97.1 C98.2 D111.1(+) D114.A D117.A IC64.8(VSS) IC64.11(D) IC66.8(GND) IC67.12(P:GND) IC68.2(GND) IC68.2@1(GND) IC69.1(GND) IC70.1(A:T1) IC70.8(P:VSS) IC70.15(B:T1) IC71.2(GND) IC71.2@1(GND) IC72.4(P:V-) Q79.2(S) Q81.2(S) Q83.2(S) R416.1 R422.1 R426.1 R427.2 R436.2 R438.1 R439.1 R447.1 R448.2 R452.2 R453.2 R454.1 X22.13 X22.18 X22.23 X23.5 X24.1 ; also sheet 2,3,4,5,6,7,9,10,12,13,14
N$1600: R409.2 R411.1
N$1601: 18.9 D98.1(+) D99.1(+) JP38.1 JP39.2 TP203.TP(PP)
N$1602: IC64.10(A) R414.1 R451.1 R451.2 X22.4 X23.2
N$1603: IC64.13(B) R413.1 R450.1 R450.2 X22.3 X23.3
N$1604: D111.2(-) Q74.2(C) START8.TP(PP) X22.5
N$1605: IC64.12(C) R412.1 R449.1 R449.2 X22.2 X23.4
N$1606: 18.7 LED47.A TP201.TP(PP) X22.8
N$1607: 18.2 D100.2(-) LED43.K(C) TP196.TP(PP) X22.12
N$1608: 18.3 D99.2(-) LED44.K(C) TP197.TP(PP) X22.11
N$1609: 18.4 D98.2(-) LED45.K(C) TP198.TP(PP) X22.10
N$1610: 18.8 D104.2(-) LED48.K(C) TP202.TP(PP) X22.14
N$1611: 17.9 D95.1(+) TP193.TP(PP) X22.17
N$1612: 17.11 D96.1(+) TP195.TP(PP) X22.19
N$1613: R415.2 X22.22
N$1614: C90.1 IC72.3(A:+IN) R415.1
N$1615: IC67.1(B:OUT) R419.2 R424.2
N$1616: C87.1 R419.1 R420.2
N$1617: C88.1 IC67.4(A:-IN) IC67.10(D:-IN) R420.1
N$1618: IC67.5(A:+IN) IC67.11(D:+IN) R421.1 R422.2 R423.2
N$1619: C91.1 IC67.9(C:+IN) R426.2 R432.2
N$1620: C92.2 IC67.14(C:OUT) R425.2
N$1621: Q77.1(B) R425.1
N$1622: IC64.2(Q2) IC66.7(I7)
N$1623: 17.5 IC66.12(O5) TP189.TP(PP)
N$1624: IC64.1(Q4) IC66.4(I4)
N$1625: 18.10 TP204.TP(PP) X22.15
N$1626: 18.5 D97.2(-) LED46.K(C) TP199.TP(PP) X22.9
N$1627: D97.1(+) R409.1
N$1628: IC64.6(Q5) IC66.3(I3)
N$1629: 17.4 IC66.10(O7) TP188.TP(PP)
N$1630: IC65.1(ADJ) R410.1 R417.2 X22.7
N$1631: IC67.6(B:-IN) IC67.8(C:-IN) R417.1
N$1632: 17.2 Q76.2(C) TP186.TP(PP)
N$1633: 17.1 D116.2(-) TP185.TP(PP)
N$1647: R437.2 X22.16
N$1648: IC64.15(Q3) IC66.5(I5)
N$1649: 17.6 IC66.13(O4) TP190.TP(PP)
N$1650: 17.7 IC66.14(O3) TP191.TP(PP)
N$1651: 18.6 JP37.2 TP200.TP(PP)
N$1652: LED47.K(C)
N$1653: LED43.A LED44.A LED45.A LED46.A LED48.A
N$1654: Q74.1(B) R429.2
N$1655: IC64.3(Q0) IC66.1(I1) IC66.2(I2) Q80.1(G) Q81.1(G)
N$1656: IC64.14(Q1) IC66.6(I6)
N$1657: 17.3 IC66.11(O6) TP187.TP(PP)
N$1658: Q75.1(B) Q75.2(C) Q76.1(B) R427.1 R448.1 X24.2
N$1659: Q76.3(E) R431.2
N$1660: Q75.3(E) R430.2
N$1661: IC67.7(B:+IN) R418.1 R432.1
N$1662: IC72.2(A:-IN) R416.2
N$1663: Q78.1(B) R433.2 R453.1
N$1664: Q79.3(D) R434.2
N$1665: IC65.2(VO) R410.2
N$1666: IC65.3(VI) Q77.2(C)
N$1667: IC69.5(CV)
N$1668: IC69.3(Q) IC70.4(A:A) IC70.12(B:A)
N$1669: D113.1(+) R437.1
N$1670: 17.10 D95.2(-) D96.2(-) JP40.1 TP194.TP(PP)
N$1671: JP40.2 R438.2 R439.2
N$1672: IC70.9(B:!Q) IC70.11(B:B) R442.2
N$1673: C95.1 IC70.14(B:T2) R440.1
N$1674: JP36.1 R441.2
N$1675: IC66.15(O2) R429.1
N$1676: 18.12 R442.1 TP207.TP(PP)
N$1677: D100.1(+) JP38.2
N$1678: IC72.1(A:OUT) R443.2
N$1679: C96.1 R443.1 R444.1
N$1680: IC72.5(B:+IN) Q81.3(D) R444.2 R445.2
N$1681: IC72.6(B:-IN) R446.1 R447.2
N$1682: D104.1(+) JP39.1
N$1683: JP37.3 R434.1
N$1684: IC67.13(D:OUT) JP37.1 Q79.1(G) R435.2
N$1685: R428.1 X22.21
N$1686: IC66.16(O1) Q80.3(D) R455.1
N$1687: D115.2(-) R458.1 R459.1
N$1688: 17.8 R455.2 TP192.TP(PP)
N$1689: Q80.2(S) R454.2
N$1690: D116.1(+) X22.1
N$1691: Q78.3(E) R452.1
N$1692: C93.2 D113.2(-) D117.C IC69.2(TR) IC69.6(THR) R436.1
N$1693: Q82.1(B) R456.1
N$1694: Q83.3(D) R456.2
N$1695: Q82.2(C) R411.2 SJMP8.2
N$1696: IC72.7(B:OUT) R428.2 R433.1 R445.1
N$1697: IC67.2(A:OUT) R423.1
N$1698: IC70.7(A:!Q) Q83.1(G)
N$1699: C97.2 IC70.2(A:T2) R457.1
V+: D115.1(+) Q74.3(E) Q77.3(E) Q82.3(E) SJMP8.1 X22.6 ; also sheet 2,3,4,5,6,7,9,10,12,13,14
VCC: 6V8.TP(PP) C89.1 IC67.3(P:V+) IC68.1(OUT) IC72.8(P:V+) R418.2 R421.2 R424.1 R446.2 ; also sheet 2,3,4,5,6,7,9,10,12,13,14
Unconnected: IC64.4(Q7) IC64.5(Q9) IC64.7(Q6) IC64.9(Q8) IC69.7(DIS) IC70.6(A:Q) IC70.10(B:Q) X22.20 X22.24

### Notes on the sheet
- Externe Beschaltung
- Variante "eine LED leuchtet"
- Variante "alle LEDs bis und
   mit Gang X leuchten"
- Anzeige:
- Klemmleisten
  Ausgang:
- Gang 1
- DauerPlus
  Konstant-Strom für LEDs
  Gang 1
  Gang 2
  Gang 3
  Gang 4
  Gang 5
  Neutrallampe
  Blinker rechts
  Blinker zusammen
  Blinker links
  Masse
- Gang 1
- Gang 2
- Gang 2
- Gang 3
- Gang 3
- Gang 1 | Gang 2 | Gang 3 | Gang 4 | Gang 5
- Gang 4
- Gang 4 | Klemmleisten Ausgang:
- Gang 5
- Gang 5
- Zündugsplus
  Choke
  Öldrucklampe
  Temperaturlampe
  Ladekontrolllampe
  Tankgeber (100hm)
  ABS-Lampe
  Lampentest
  Warnlampe
  Fernlichtlampe
  Geschwindigkeitssignal
  Menütaster
- Stromquelle für Gang
  LEDs. Für mehr als 12mA
  muss ein Widerstand "R_user"
  eingelötet werden. Für weniger
  muss der 1kOhm SMD Widerstand
  neben R_user entfernt werden
  I = 12V/1kOhm(default)+12V/R_user
  I= 12mA (default) + 12V/R_user
  Beispiel:
  R_user      Strom in LEDs
  1 kOhm     22-26mA
  ohne       11-13mA
- Externe Beschaltung
- an Zündungsplus anhängen
  (Neutral leuchtet wenn Gang 0
  eingelegt und Zündschlüssel steckt )
- Neutrallampe
  für eigene
  Ganganzeige
- DauerPlus Batterie 12V (rot weiss)
  Ganganzeige Signal C (gelb weiss)
  Ganganzeige Signal B (gelb schwarz)
  Ganganzeige Signal A (gelb dunkelblau)
  12V/350mA zum Starknopf (schwarz grün)
  Zündungsplus 12V (grün schwarz)
  Reservelampe (weiss)
  ABS Leuchte (blau)
  Ladekontrollleuchte (schaltet auf Masse) (violett schwarz)
  Temperaturleuchte (schaltet auf Masse) (braun schwarz)
  Öldruckleuchte (schaltet auf Masse) (braun grün)
  Chokelampe (schaltet auf Masse) (violett weiss)
- BL resistors
- 1k
- an Ausgang "Neutrallampe" anhängen
- Masse (braun)
  Lampentest (schaltet auf Masse)(weiss blau)
  Fernlichtlampe (12V) (weiss)
  Drehzahl Zündspule (schwarz blau)
  Blinker rechts (blau scharz)
  Masse (braun)
  Blinker links (blau rot)
  nicht angeschlossen
  Tachosiganl zum Blinrelais (balu grün)
  Tachogeber (gelb)
  Masse Tachobeger (braun)
  Tachobeleuchtung (12V Zündungsplus) (grau blau)
- RES | BAR
- 4.7V | rising edge trigger A
- non retriggerable
- ZündungsPlus
- current source 96mA
- 6V regulated for Opamps
- nicht bestückt
- retriggerable
- Standard panel Fiducial | panel Fiducial with solder mask around fiducial

## Sheet 12 of 14
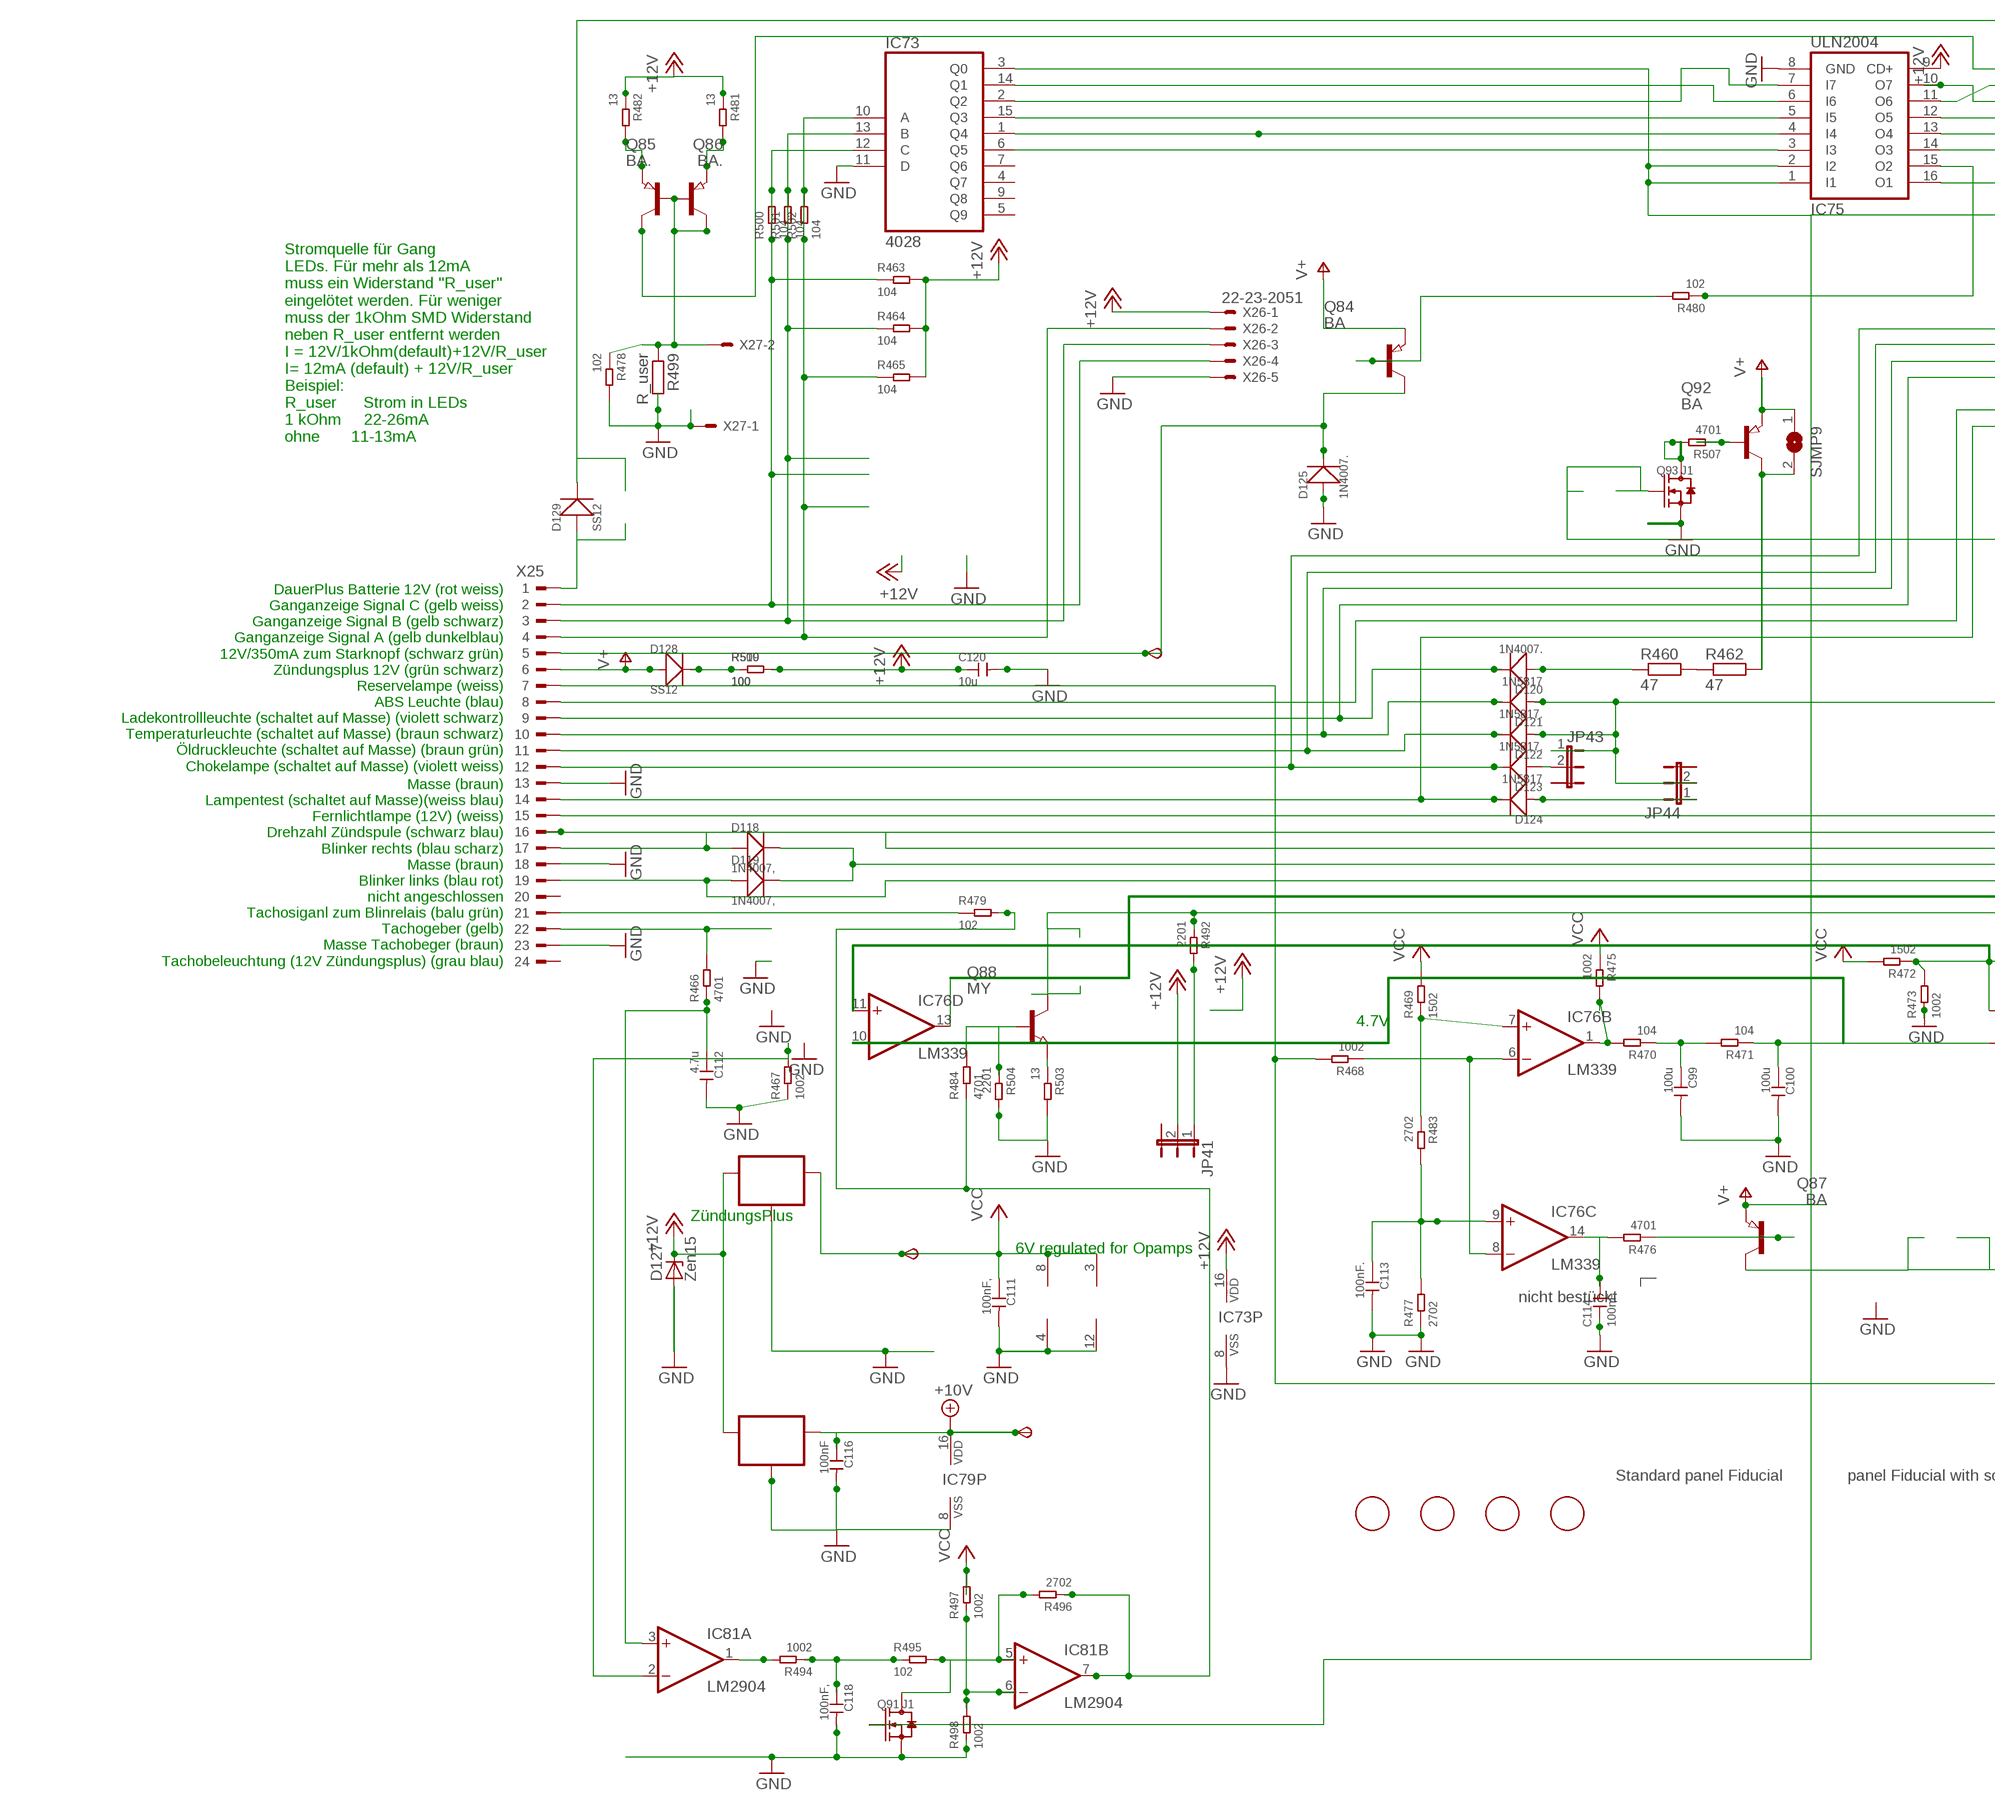
[diagram p20: schematic, sheet 12, part 1 of 2]
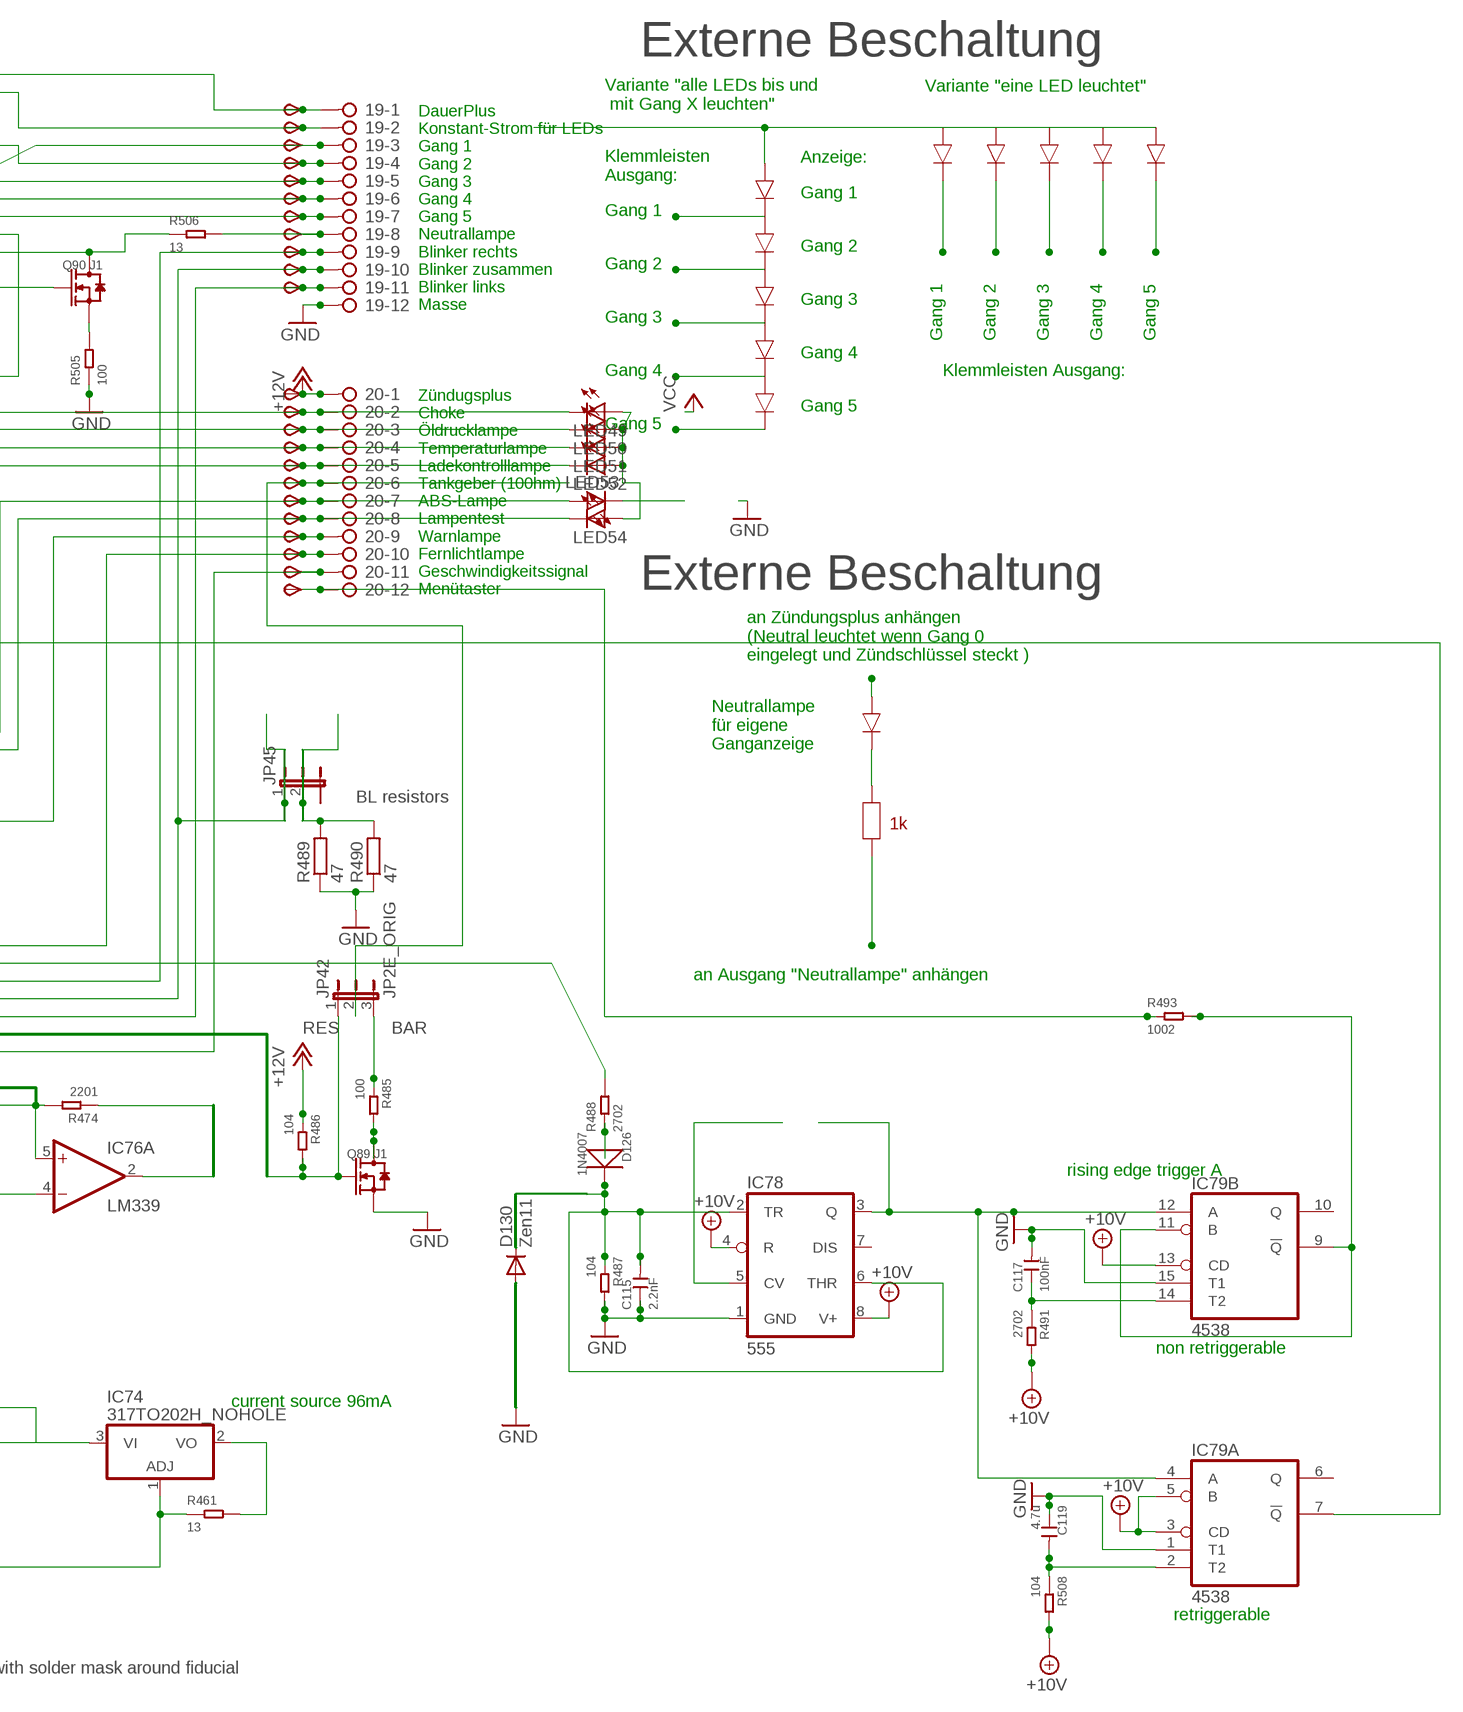
[diagram p21: schematic, sheet 12, part 2 of 2]

### Parts
6V9  TPSB2.0  [B2.0]
10V9  TPSB2.0  [B2.0]
19  2081-1132  [12-PIN]
20  2081-1132  [12-PIN]
C99  100u  CERAMIC-100UF-6.3V-20%-X5R(1206)  [C1206]
C100  100u  CERAMIC-100UF-6.3V-20%-X5R(1206)  [C1206]
C111  100nF,  CERAMIC-100NF-50V-10%-X7R(0805)  [C0805]
C112  4.7u  CERAMIC-4.7UF-25V-10%-X5R(0805)  [C0805]
C113  100nF.  CERAMIC-100NF-50V-10%-X7R(0805)  [C0805]
C114  100nF.  CERAMIC-100NF-50V-10%-X7R(0805)  [C0805]
C115  2.2nF  CERAMIC-100NF-50V-10%-X7R(0805)  [C0805]
C116  100nF  CERAMIC-100NF-50V-10%-X7R(0805)  [C0805]
C117  100nF  CERAMIC-100NF-50V-10%-X7R(0805)  [C0805]
C118  100nF,  CERAMIC-100NF-50V-10%-X7R(0805)  [C0805]
C119  4.7u  CERAMIC-4.7UF-25V-10%-X5R(0805)  [C0805]
C120  10u  CERAMIC-100UF-6.3V-20%-X5R(1206)  [C1206]
D118  1N4007,  DIODE-GEN-PURPOSE-1KV-1A(DO-214AC)  [DO-214AC]
D119  1N4007,  DIODE-GEN-PURPOSE-1KV-1A(DO-214AC)  [DO-214AC]
D120  1N4007.  DIODE-GEN-PURPOSE-1KV-1A(DO-214AC)  [DO-214AC]
D121  1N5817  DIODE-GEN-PURPOSE-1KV-1A(DO-214AC)DO-214AC/1206  [DO-214AC_SLIM]
D122  1N5817.  DIODE-GEN-PURPOSE-1KV-1A(DO-214AC)DO-214AC/1206  [DO-214AC_SLIM]
D123  1N5817.  DIODE-GEN-PURPOSE-1KV-1A(DO-214AC)DO-214AC/1206  [DO-214AC_SLIM]
D124  1N5817  DIODE-GEN-PURPOSE-1KV-1A(DO-214AC)DO-214AC/1206  [DO-214AC_SLIM]
D125  1N4007.  DIODE-GEN-PURPOSE-1KV-1A(DO-214AC)  [DO-214AC]
D126  1N4007  DIODE-GEN-PURPOSE-1KV-1A(DO-214AC)  [DO-214AC]
D127  Zen15  SM6T  [DO214AA]
D128  SS12  DIODE-GEN-PURPOSE-1KV-1A(DO-214AC)DO-214AC/1206  [DO-214AC_SLIM]
D129  SS12  DIODE-GEN-PURPOSE-1KV-1A(DO-214AC)DO-214AC/1206  [DO-214AC_SLIM]
D130  Zen11  CGRM4001-G  [SOD-123_MINI-SMA]
FID37  FIDUCIAL  [FIDUCIAL_1MM]
FID38  FIDUCIAL  [FIDUCIAL_1MM]
FID39  FIDUCIAL  [FIDUCIAL_1MM]
FID40  FIDUCIAL  [FIDUCIAL_1MM]
IC73  4028  4028D  [SO16]
IC74  317TO202H_NOHOLE  [TO220H_NOHOLE]
IC75  ULN2004  ULN2004AD  [SO16]
IC76  LM339  LM339D  [SO14]
IC77  78L06  78LXXSOT89_ROUND  [SOT89_ROUND]
IC78  555  NE555D  [SO08]
IC79  4538  4538D  [SO16]
IC80  78L10  78LXXSOT89_ROUND  [SOT89_ROUND]
IC81  LM2904  LM358D  [SO08]
JP41  JP2EJP2_SMALLPADS  [JP2_SMALLPADS]
JP42  JP2E_ORIG  [JP2_ORIG_SMALLPADS]
JP43  JP2EJP2_SMALLPADS  [JP2_SMALLPADS]
JP44  JP2EJP2_SMALLPADS  [JP2_SMALLPADS]
JP45  JP2EJP2_SMALLPADS  [JP2_SMALLPADS]
LED49  LEDLD260  [LD260]
LED50  LEDLD260  [LD260]
LED51  LEDLD260  [LD260]
LED52  LEDLD260  [LD260]
LED53  LEDLD260  [LD260]
LED54  LEDLD260  [LD260]
Q84  BA  PNP-TRANSISTOR_SOT89  [SOT89]
Q85  BA.  PNP-TRANSISTOR_SOT89  [SOT89]
Q86  BA.  PNP-TRANSISTOR_SOT89  [SOT89]
Q87  BA  PNP-TRANSISTOR_SOT89  [SOT89]
Q88  MY  NPN-TRANSISTOR_SOT89  [SOT89]
Q89  J1  SMD-MOSFET-N-CH-50V-200MA-BSS138W-7-F(SOT-23)  [SOT-23]
Q90  J1  SMD-MOSFET-N-CH-50V-200MA-BSS138W-7-F(SOT-23)  [SOT-23]
Q91  J1  SMD-MOSFET-N-CH-50V-200MA-BSS138W-7-F(SOT-23)  [SOT-23]
Q92  BA  PNP-TRANSISTOR_SOT89  [SOT89]
Q93  J1  SMD-MOSFET-N-CH-50V-200MA-BSS138W-7-F(SOT-23)  [SOT-23]
R460  47  R-EU_V235/17_1MM  [V235/17_1MM]
R461  13  SMD-RES-13R-5%-1/4W(1206)  [R1206]
R462  47  R-EU_V235/17_1MM  [V235/17_1MM]
R463  104  SMD-RES-10K-1%-1/8W(0805)  [R0805]
R464  104  SMD-RES-10K-1%-1/8W(0805)  [R0805]
R465  104  SMD-RES-10K-1%-1/8W(0805)  [R0805]
R466  4701  SMD-RES-4.7K-5%-1/8W(0805)  [R0805]
R467  1002  SMD-RES-10K-1%-1/8W(0805)  [R0805]
R468  1002  SMD-RES-10K-1%-1/8W(0805)  [R0805]
R469  1502  SMD-RES-10K-1%-1/8W(0805)  [R0805]
R470  104  SMD-RES-10K-1%-1/8W(0805)  [R0805]
R471  104  SMD-RES-10K-1%-1/8W(0805)  [R0805]
R472  1502  SMD-RES-10K-1%-1/8W(0805)  [R0805]
R473  1002  SMD-RES-10K-1%-1/8W(0805)  [R0805]
R474  2201  SMD-RES-2.2K-5%-1/8W(0805)  [R0805]
R475  1002  SMD-RES-10K-1%-1/8W(0805)  [R0805]
R476  4701  SMD-RES-4.7K-5%-1/8W(0805)  [R0805]
R477  2702  SMD-RES-4.7K-5%-1/8W(0805)  [R0805]
R478  102  SMD-RES-1K-5%-1/8W(0805)  [R0805]
R479  102  SMD-RES-220R-5%-1/8W(0805)  [R0805]
R480  102  SMD-RES-1K-5%-1/8W(0805)  [R0805]
R481  13  SMD-RES-13R-5%-1/4W(1206)  [R1206]
R482  13  SMD-RES-13R-5%-1/4W(1206)  [R1206]
R483  2702  SMD-RES-4.7K-5%-1/8W(0805)  [R0805]
R484  4701  SMD-RES-4.7K-5%-1/8W(0805)  [R0805]
R485  100  SMD-RES-2.2K-5%-1/8W(0805)  [R0805]
R486  104  SMD-RES-10K-1%-1/8W(0805)  [R0805]
R487  104  SMD-RES-10K-1%-1/8W(0805)  [R0805]
R488  2702  SMD-RES-10K-1%-1/8W(0805)  [R0805]
R489  47  R-EU_V235/17_1MM  [V235/17_1MM]
R490  47  R-EU_V235/17_1MM  [V235/17_1MM]
R491  2702  SMD-RES-4.7K-5%-1/8W(0805)  [R0805]
R492  2201  SMD-RES-2.2K-5%-1/8W(0805)  [R0805]
R493  1002  SMD-RES-4.7K-5%-1/8W(0805)  [R0805]
R494  1002  SMD-RES-10K-1%-1/8W(0805)  [R0805]
R495  102  SMD-RES-1K-5%-1/8W(0805)  [R0805]
R496  2702  SMD-RES-4.7K-5%-1/8W(0805)  [R0805]
R497  1002  SMD-RES-1K-5%-1/8W(0805)  [R0805]
R498  1002  SMD-RES-1K-5%-1/8W(0805)  [R0805]
R499  R_user  R-EU_R0805  [R0805]
R500  104  SMD-RES-10K-1%-1/8W(0805)  [R0805]
R501  104  SMD-RES-10K-1%-1/8W(0805)  [R0805]
R502  104  SMD-RES-10K-1%-1/8W(0805)  [R0805]
R503  13  SMD-RES-13R-5%-1/4W(1206)  [R1206]
R504  2201  SMD-RES-1K-5%-1/8W(0805)  [R0805]
R505  100  SMD-RES-220R-5%-1/8W(0805)  [R0805]
R506  13  SMD-RES-13R-5%-1/4W(1206)  [R1206]
R507  4701  SMD-RES-4.7K-5%-1/8W(0805)  [R0805]
R508  104  SMD-RES-4.7K-5%-1/8W(0805)  [R0805]
R509  100  SMD-RES-2.2K-5%-1/8W(0805)  [R0805]
R510  100  SMD-RES-2.2K-5%-1/8W(0805)  [R0805]
SJMP9  SJ  [SJ]
START9  TPSB2.0  [B2.0]
TP208  TPSB2.0  [B2.0]
TP209  TPSB2.0  [B2.0]
TP210  TPSB2.0  [B2.0]
TP211  TPSB2.0  [B2.0]
TP212  TPSB2.0  [B2.0]
TP213  TPSB2.0  [B2.0]
TP214  TPSB2.0  [B2.0]
TP215  TPSB2.0  [B2.0]
TP216  TPSB2.0  [B2.0]
TP217  TPSB2.0  [B2.0]
TP218  TPSB2.0  [B2.0]
TP219  TPSB2.0  [B2.0]
TP220  TPSB2.0  [B2.0]
TP221  TPSB2.0  [B2.0]
TP222  TPSB2.0  [B2.0]
TP223  TPSB2.0  [B2.0]
TP224  TPSB2.0  [B2.0]
TP225  TPSB2.0  [B2.0]
TP226  TPSB1,27  [B1,27]
TP227  TPSB2.0  [B2.0]
TP228  TPSB2.0  [B2.0]
TP229  TPSB2.0  [B2.0]
TP230  TPSB2.0  [B2.0]
X25  CON_BMWV2  [24-PIN_V2]
X26  22-23-2051  [22-23-2051]
X27  22-23-2021  [22-23-2021]

### Nets
+10V: 10V9.TP(PP) C116.1 IC78.4(R) IC78.8(V+) IC79.3(A:CD) IC79.5(A:B) IC79.13(B:CD) IC79.16(P:VDD) IC80.1(OUT) R491.2 R508.2 ; also sheet 2,3,4,5,6,7,9,10,11,13,14
+12V: 20.1 C120.1 D127.C IC73.16(VDD) IC75.9(CD+) IC77.3(IN) IC80.3(IN) JP41.2 R463.2 R464.2 R465.2 R481.1 R482.1 R486.1 R509.2 R510.2 TP229.TP(PP) X26.1 ; also sheet 2,3,4,5,6,7,9,10,11,13,14
+12V10: 20.11 Q88.2(C) R492.1 TP228.TP(PP)
GND: 19.12 C99.2 C100.2 C111.2 C112.2 C113.2 C114.1 C115.1 C116.2 C117.2 C118.2 C119.1 C120.2 D125.1(+) D127.A D130.A IC73.8(VSS) IC73.11(D) IC75.8(GND) IC76.12(P:GND) IC77.2(GND) IC77.2@1(GND) IC78.1(GND) IC79.1(A:T1) IC79.8(P:VSS) IC79.15(B:T1) IC80.2(GND) IC80.2@1(GND) IC81.4(P:V-) Q89.2(S) Q91.2(S) Q93.2(S) R467.1 R473.1 R477.1 R478.2 R487.2 R489.1 R490.1 R498.1 R499.2 R503.2 R504.2 R505.1 X25.13 X25.18 X25.23 X26.5 X27.1 ; also sheet 2,3,4,5,6,7,9,10,11,13,14
N$1700: R460.2 R462.1
N$1701: 20.9 D121.1(+) D122.1(+) JP43.1 JP44.2 TP226.TP(PP)
N$1702: IC73.10(A) R465.1 R502.1 R502.2 X25.4 X26.2
N$1703: IC73.13(B) R464.1 R501.1 R501.2 X25.3 X26.3
N$1704: D125.2(-) Q84.2(C) START9.TP(PP) X25.5
N$1705: IC73.12(C) R463.1 R500.1 R500.2 X25.2 X26.4
N$1706: 20.7 LED53.A TP224.TP(PP) X25.8
N$1707: 20.2 D123.2(-) LED49.K(C) TP219.TP(PP) X25.12
N$1708: 20.3 D122.2(-) LED50.K(C) TP220.TP(PP) X25.11
N$1709: 20.4 D121.2(-) LED51.K(C) TP221.TP(PP) X25.10
N$1710: 20.8 D124.2(-) LED54.K(C) TP225.TP(PP) X25.14
N$1711: 19.9 D118.1(+) TP216.TP(PP) X25.17
N$1712: 19.11 D119.1(+) TP218.TP(PP) X25.19
N$1713: R466.2 X25.22
N$1714: C112.1 IC81.3(A:+IN) R466.1
N$1715: IC76.1(B:OUT) R470.2 R475.2
N$1716: C99.1 R470.1 R471.2
N$1717: C100.1 IC76.4(A:-IN) IC76.10(D:-IN) R471.1
N$1718: IC76.5(A:+IN) IC76.11(D:+IN) R472.1 R473.2 R474.2
N$1719: C113.1 IC76.9(C:+IN) R477.2 R483.2
N$1720: C114.2 IC76.14(C:OUT) R476.2
N$1721: Q87.1(B) R476.1
N$1722: IC73.2(Q2) IC75.7(I7)
N$1723: 19.5 IC75.12(O5) TP212.TP(PP)
N$1724: IC73.1(Q4) IC75.4(I4)
N$1725: 20.10 TP227.TP(PP) X25.15
N$1726: 20.5 D120.2(-) LED52.K(C) TP222.TP(PP) X25.9
N$1727: D120.1(+) R460.1
N$1728: IC73.6(Q5) IC75.3(I3)
N$1729: 19.4 IC75.10(O7) TP211.TP(PP)
N$1730: IC74.1(ADJ) R461.1 R468.2 X25.7
N$1731: IC76.6(B:-IN) IC76.8(C:-IN) R468.1
N$1732: 19.2 Q86.2(C) TP209.TP(PP)
N$1733: 19.1 D129.2(-) TP208.TP(PP)
N$1747: R488.2 X25.16
N$1748: IC73.15(Q3) IC75.5(I5)
N$1749: 19.6 IC75.13(O4) TP213.TP(PP)
N$1750: 19.7 IC75.14(O3) TP214.TP(PP)
N$1751: 20.6 JP42.2 TP223.TP(PP)
N$1752: LED53.K(C)
N$1753: LED49.A LED50.A LED51.A LED52.A LED54.A
N$1754: Q84.1(B) R480.2
N$1755: IC73.3(Q0) IC75.1(I1) IC75.2(I2) Q90.1(G) Q91.1(G)
N$1756: IC73.14(Q1) IC75.6(I6)
N$1757: 19.3 IC75.11(O6) TP210.TP(PP)
N$1758: Q85.1(B) Q85.2(C) Q86.1(B) R478.1 R499.1 X27.2
N$1759: Q86.3(E) R482.2
N$1760: Q85.3(E) R481.2
N$1761: IC76.7(B:+IN) R469.1 R483.1
N$1762: IC81.2(A:-IN) R467.2
N$1763: Q88.1(B) R484.2 R504.1
N$1764: Q89.3(D) R485.2
N$1765: IC74.2(VO) R461.2
N$1766: IC74.3(VI) Q87.2(C)
N$1767: IC78.5(CV)
N$1768: IC78.3(Q) IC79.4(A:A) IC79.12(B:A)
N$1769: D126.1(+) R488.1
N$1770: 19.10 D118.2(-) D119.2(-) JP45.1 TP217.TP(PP)
N$1771: JP45.2 R489.2 R490.2
N$1772: IC79.9(B:!Q) IC79.11(B:B) R493.2
N$1773: C117.1 IC79.14(B:T2) R491.1
N$1774: JP41.1 R492.2
N$1775: IC75.15(O2) R480.1
N$1776: 20.12 R493.1 TP230.TP(PP)
N$1777: D123.1(+) JP43.2
N$1778: IC81.1(A:OUT) R494.2
N$1779: C118.1 R494.1 R495.1
N$1780: IC81.5(B:+IN) Q91.3(D) R495.2 R496.2
N$1781: IC81.6(B:-IN) R497.1 R498.2
N$1782: D124.1(+) JP44.1
N$1783: JP42.3 R485.1
N$1784: IC76.13(D:OUT) JP42.1 Q89.1(G) R486.2
N$1785: R479.1 X25.21
N$1786: IC75.16(O1) Q90.3(D) R506.1
N$1787: D128.2(-) R509.1 R510.1
N$1788: 19.8 R506.2 TP215.TP(PP)
N$1789: Q90.2(S) R505.2
N$1790: D129.1(+) X25.1
N$1791: Q88.3(E) R503.1
N$1792: C115.2 D126.2(-) D130.C IC78.2(TR) IC78.6(THR) R487.1
N$1793: Q92.1(B) R507.1
N$1794: Q93.3(D) R507.2
N$1795: Q92.2(C) R462.2 SJMP9.2
N$1796: IC81.7(B:OUT) R479.2 R484.1 R496.1
N$1797: IC76.2(A:OUT) R474.1
N$1798: IC79.7(A:!Q) Q93.1(G)
N$1799: C119.2 IC79.2(A:T2) R508.1
V+: D128.1(+) Q84.3(E) Q87.3(E) Q92.3(E) SJMP9.1 X25.6 ; also sheet 2,3,4,5,6,7,9,10,11,13,14
VCC: 6V9.TP(PP) C111.1 IC76.3(P:V+) IC77.1(OUT) IC81.8(P:V+) R469.2 R472.2 R475.1 R497.2 ; also sheet 2,3,4,5,6,7,9,10,11,13,14
Unconnected: IC73.4(Q7) IC73.5(Q9) IC73.7(Q6) IC73.9(Q8) IC78.7(DIS) IC79.6(A:Q) IC79.10(B:Q) X25.20 X25.24

### Notes on the sheet
- Externe Beschaltung
- Variante "eine LED leuchtet"
- Variante "alle LEDs bis und
   mit Gang X leuchten"
- Anzeige:
- Klemmleisten
  Ausgang:
- Gang 1
- DauerPlus
  Konstant-Strom für LEDs
  Gang 1
  Gang 2
  Gang 3
  Gang 4
  Gang 5
  Neutrallampe
  Blinker rechts
  Blinker zusammen
  Blinker links
  Masse
- Gang 1
- Gang 2
- Gang 2
- Gang 3
- Gang 3
- Gang 1 | Gang 2 | Gang 3 | Gang 4 | Gang 5
- Gang 4
- Gang 4 | Klemmleisten Ausgang:
- Gang 5
- Gang 5
- Zündugsplus
  Choke
  Öldrucklampe
  Temperaturlampe
  Ladekontrolllampe
  Tankgeber (100hm)
  ABS-Lampe
  Lampentest
  Warnlampe
  Fernlichtlampe
  Geschwindigkeitssignal
  Menütaster
- Stromquelle für Gang
  LEDs. Für mehr als 12mA
  muss ein Widerstand "R_user"
  eingelötet werden. Für weniger
  muss der 1kOhm SMD Widerstand
  neben R_user entfernt werden
  I = 12V/1kOhm(default)+12V/R_user
  I= 12mA (default) + 12V/R_user
  Beispiel:
  R_user      Strom in LEDs
  1 kOhm     22-26mA
  ohne       11-13mA
- Externe Beschaltung
- an Zündungsplus anhängen
  (Neutral leuchtet wenn Gang 0
  eingelegt und Zündschlüssel steckt )
- Neutrallampe
  für eigene
  Ganganzeige
- DauerPlus Batterie 12V (rot weiss)
  Ganganzeige Signal C (gelb weiss)
  Ganganzeige Signal B (gelb schwarz)
  Ganganzeige Signal A (gelb dunkelblau)
  12V/350mA zum Starknopf (schwarz grün)
  Zündungsplus 12V (grün schwarz)
  Reservelampe (weiss)
  ABS Leuchte (blau)
  Ladekontrollleuchte (schaltet auf Masse) (violett schwarz)
  Temperaturleuchte (schaltet auf Masse) (braun schwarz)
  Öldruckleuchte (schaltet auf Masse) (braun grün)
  Chokelampe (schaltet auf Masse) (violett weiss)
- BL resistors
- 1k
- an Ausgang "Neutrallampe" anhängen
- Masse (braun)
  Lampentest (schaltet auf Masse)(weiss blau)
  Fernlichtlampe (12V) (weiss)
  Drehzahl Zündspule (schwarz blau)
  Blinker rechts (blau scharz)
  Masse (braun)
  Blinker links (blau rot)
  nicht angeschlossen
  Tachosiganl zum Blinrelais (balu grün)
  Tachogeber (gelb)
  Masse Tachobeger (braun)
  Tachobeleuchtung (12V Zündungsplus) (grau blau)
- RES | BAR
- 4.7V | rising edge trigger A
- non retriggerable
- ZündungsPlus
- current source 96mA
- 6V regulated for Opamps
- nicht bestückt
- retriggerable
- Standard panel Fiducial | panel Fiducial with solder mask around fiducial